# Altium project span-ion-cfd-respin.PrjPcb (part 1 of 2)
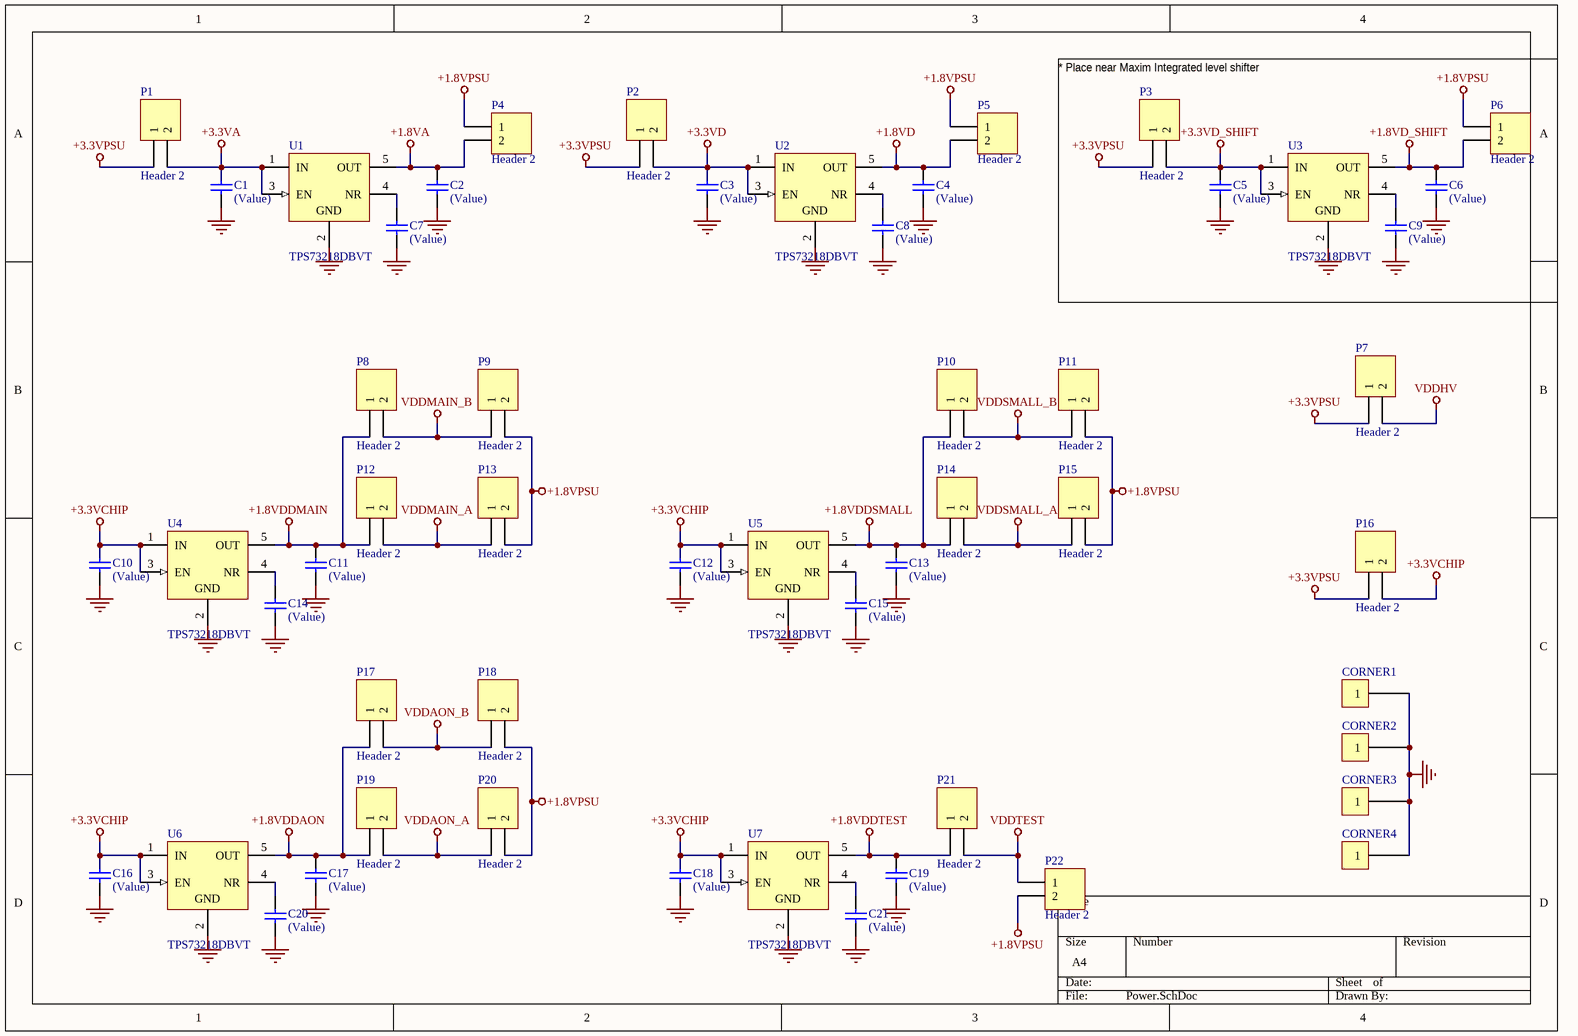
[diagram p0: Power.SchDoc]
6 sheets, 265 parts. Net scope: global (net labels, ports and power ports of the same name join across sheets).
Board file: CFD_2Channel.PcbDoc
Sheets:
  Power.SchDoc
  Teensy_Interface.SchDoc
  Mux_Demux.SchDoc
  Dual_Channel.SchDoc
  Channel_A.SchDoc
  Channel_B.SchDoc

## Sheet Power.SchDoc
size A4; SheetNumber: 1; SheetTotal: 6

### Parts
C1  (Value)  [CAPC1608X90X35ML10T15]
C2  (Value)  [CAPC1608X90X35ML10T15]
C3  (Value)  [CAPC1608X90X35ML10T15]
C4  (Value)  [CAPC1608X90X35ML10T15]
C5  (Value)  [CAPC1608X90X35ML10T15]
C6  (Value)  [CAPC1608X90X35ML10T15]
C7  (Value)  [CAPC1608X90X35ML10T15]
C8  (Value)  [CAPC1608X90X35ML10T15]
C9  (Value)  [CAPC1608X90X35ML10T15]
C10  (Value)  [CAPC1608X90X35ML10T15]
C11  (Value)  [CAPC1608X90X35ML10T15]
C12  (Value)  [CAPC1608X90X35ML10T15]
C13  (Value)  [CAPC1608X90X35ML10T15]
C14  (Value)  [CAPC1608X90X35ML10T15]
C15  (Value)  [CAPC1608X90X35ML10T15]
C16  (Value)  [CAPC1608X90X35ML10T15]
C17  (Value)  [CAPC1608X90X35ML10T15]
C18  (Value)  [CAPC1608X90X35ML10T15]
C19  (Value)  [CAPC1608X90X35ML10T15]
C20  (Value)  [CAPC1608X90X35ML10T15]
C21  (Value)  [CAPC1608X90X35ML10T15]
CORNER1  Corner Mount  [CornerMount]  (value not drawn)
CORNER2  Corner Mount  [CornerMount]  (value not drawn)
CORNER3  Corner Mount  [CornerMount]  (value not drawn)
CORNER4  Corner Mount  [CornerMount]  (value not drawn)
P1  Header 2  [HDR1X2]
P2  Header 2  [HDR1X2]
P3  Header 2  [HDR1X2]
P4  Header 2  [HDR1X2]
P5  Header 2  [HDR1X2]
P6  Header 2  [HDR1X2]
P7  Header 2  [HDR1X2]
P8  Header 2  [HDR1X2]
P9  Header 2  [HDR1X2]
P10  Header 2  [HDR1X2]
P11  Header 2  [HDR1X2]
P12  Header 2  [HDR1X2]
P13  Header 2  [HDR1X2]
P14  Header 2  [HDR1X2]
P15  Header 2  [HDR1X2]
P16  Header 2  [HDR1X2]
P17  Header 2  [HDR1X2]
P18  Header 2  [HDR1X2]
P19  Header 2  [HDR1X2]
P20  Header 2  [HDR1X2]
P21  Header 2  [HDR1X2]
P22  Header 2  [HDR1X2]
U1  TPS73218DBVT  [DBV0005A_N]
U2  TPS73218DBVT  [DBV0005A_N]
U3  TPS73218DBVT  [DBV0005A_N]
U4  TPS73218DBVT  [DBV0005A_N]
U5  TPS73218DBVT  [DBV0005A_N]
U6  TPS73218DBVT  [DBV0005A_N]
U7  TPS73218DBVT  [DBV0005A_N]

### Nets
+1.8VA: C2.1 P4.2 U1.5(OUT)
+1.8VD: C4.1 P5.2 U2.5(OUT)
+1.8VD_SHIFT: C6.1 P6.2 U3.5(OUT)
+1.8VDDAON: C17.1 P17.1 P19.1 U6.5(OUT)
+1.8VDDMAIN: C11.1 P8.1 P12.1 U4.5(OUT)
+1.8VDDSMALL: C13.1 P10.1 P14.1 U5.5(OUT)
+1.8VDDTEST: C19.1 P21.1 U7.5(OUT)
+1.8VPSU: P4.1 P5.1 P6.1 P9.2 P11.2 P13.2 P15.2 P18.2 P20.2 P22.2
+3.3VA: C1.1 P1.2 U1.1(IN) U1.3(EN)
+3.3VCHIP: C10.1 C12.1 C16.1 C18.1 P16.2 U4.1(IN) U4.3(EN) U5.1(IN) U5.3(EN) U6.1(IN) U6.3(EN) U7.1(IN) U7.3(EN)
+3.3VD: C3.1 P2.2 U2.1(IN) U2.3(EN)
+3.3VD_SHIFT: C5.1 P3.2 U3.1(IN) U3.3(EN)
+3.3VPSU: P1.1 P2.1 P3.1 P7.1 P16.1
GND: C1.2 C2.2 C3.2 C4.2 C5.2 C6.2 C7.2 C8.2 C9.2 C10.2 C11.2 C12.2 C13.2 C14.2 C15.2 C16.2 C17.2 C18.2 C19.2 C20.2 C21.2 CORNER1.1 CORNER2.1 CORNER3.1 CORNER4.1 U1.2(GND) U2.2(GND) U3.2(GND) U4.2(GND) U5.2(GND) U6.2(GND) U7.2(GND)
VDDAON_A: P19.2 P20.1
VDDAON_B: P17.2 P18.1
VDDHV: P7.2
VDDMAIN_A: P12.2 P13.1
VDDMAIN_B: P8.2 P9.1
VDDSMALL_A: P14.2 P15.1
VDDSMALL_B: P10.2 P11.1
VDDTEST: P21.2 P22.1
NetC7_1: C7.1 U1.4(NR)
NetC8_1: C8.1 U2.4(NR)
NetC9_1: C9.1 U3.4(NR)
NetC14_1: C14.1 U4.4(NR)
NetC15_1: C15.1 U5.4(NR)
NetC20_1: C20.1 U6.4(NR)
NetC21_1: C21.1 U7.4(NR)

### Notes on the sheet
- * Place near Maxim Integrated level shifter

### Library data of the parts
C1-C21 = CMP-2000-04945-1: 0603; Manufacturer: Murata; Capacitance: 22pF; Tolerance (%): ±5%; Rated Voltage: 50V; Dielectric: C0G; Manufacturer URL: http://www.murata.com/; Datasheet Version: Jul-06; Package Reference: 603; Case Size/Dimension: 0603; Package Description: 2-Pin Surface Mount Device, Body 1.6 x 0.8 mm; Datasheet URL: https://datasheet.ciiva.com/11786/0900766b807a1cab-11786398.pdf
P1-P22 = Header 2: Header, 2-Pin; LatestRevisionDate: 17-Jul-2002; LatestRevisionNote: Re-released for DXP Platform.; Publisher: Altium Limited
U1-U7 = CMP-0394-00378-2: Single Output Fast Transient Response LDO, 200 mA, Fixed 1.8 V Output, 1.7 to 5.5 V Input, with Reverse Current Protection, 5-pin SOT-23 (DBV), -40 to 85 degC, Green (RoHS & no Sb/Br); Manufacturer: Texas Instruments; Iout(Max)(A): 0.25; Iq(Typ)(mA): 0.4; Accuracy(%): 1; Vout Adj(Min)(V): 1.8; Vdo(Typ)(mV): 40; SubFamily: Single Channel LDO; Vin(Min)(V): 1.7; Vin(Max)(V): 5.5; ComponentLink1URL: http://www.ti.com/; PartNumber: TPS73218DBVT; Eco-Plan: Green (RoHS & no Sb/Br); ComponentLink2Description: Datasheet; PackageVersion: 4073253-4/K; ComponentLink3URL: http://www.ti.com/litv/pdf/mpds018i; ComponentLink3Description: Package Specification; ComponentLink1Description: Manufacturer URL; Vout Adj(Max)(V): 1.8; Code_JEDEC: MO-178; ComponentLink2URL: http://www.ti.com/general/docs/lit/getliterature.tsp?genericPartNumber=TPS73218&fileType=pdf; DatasheetVersion: SBVS037O; Mounting Technology: Surface Mount; PackageReference: DBV0005A; PackageDescription: 5-Pin Plastic Small Outline, Body 1.60 Ãƒâ€” 2.90 mm, Pitch 0.95 mm; Fixed Output Options(V): 1.8

## Sheet Teensy_Interface.SchDoc
size OrCAD E; SheetNumber: 2; SheetTotal: 6
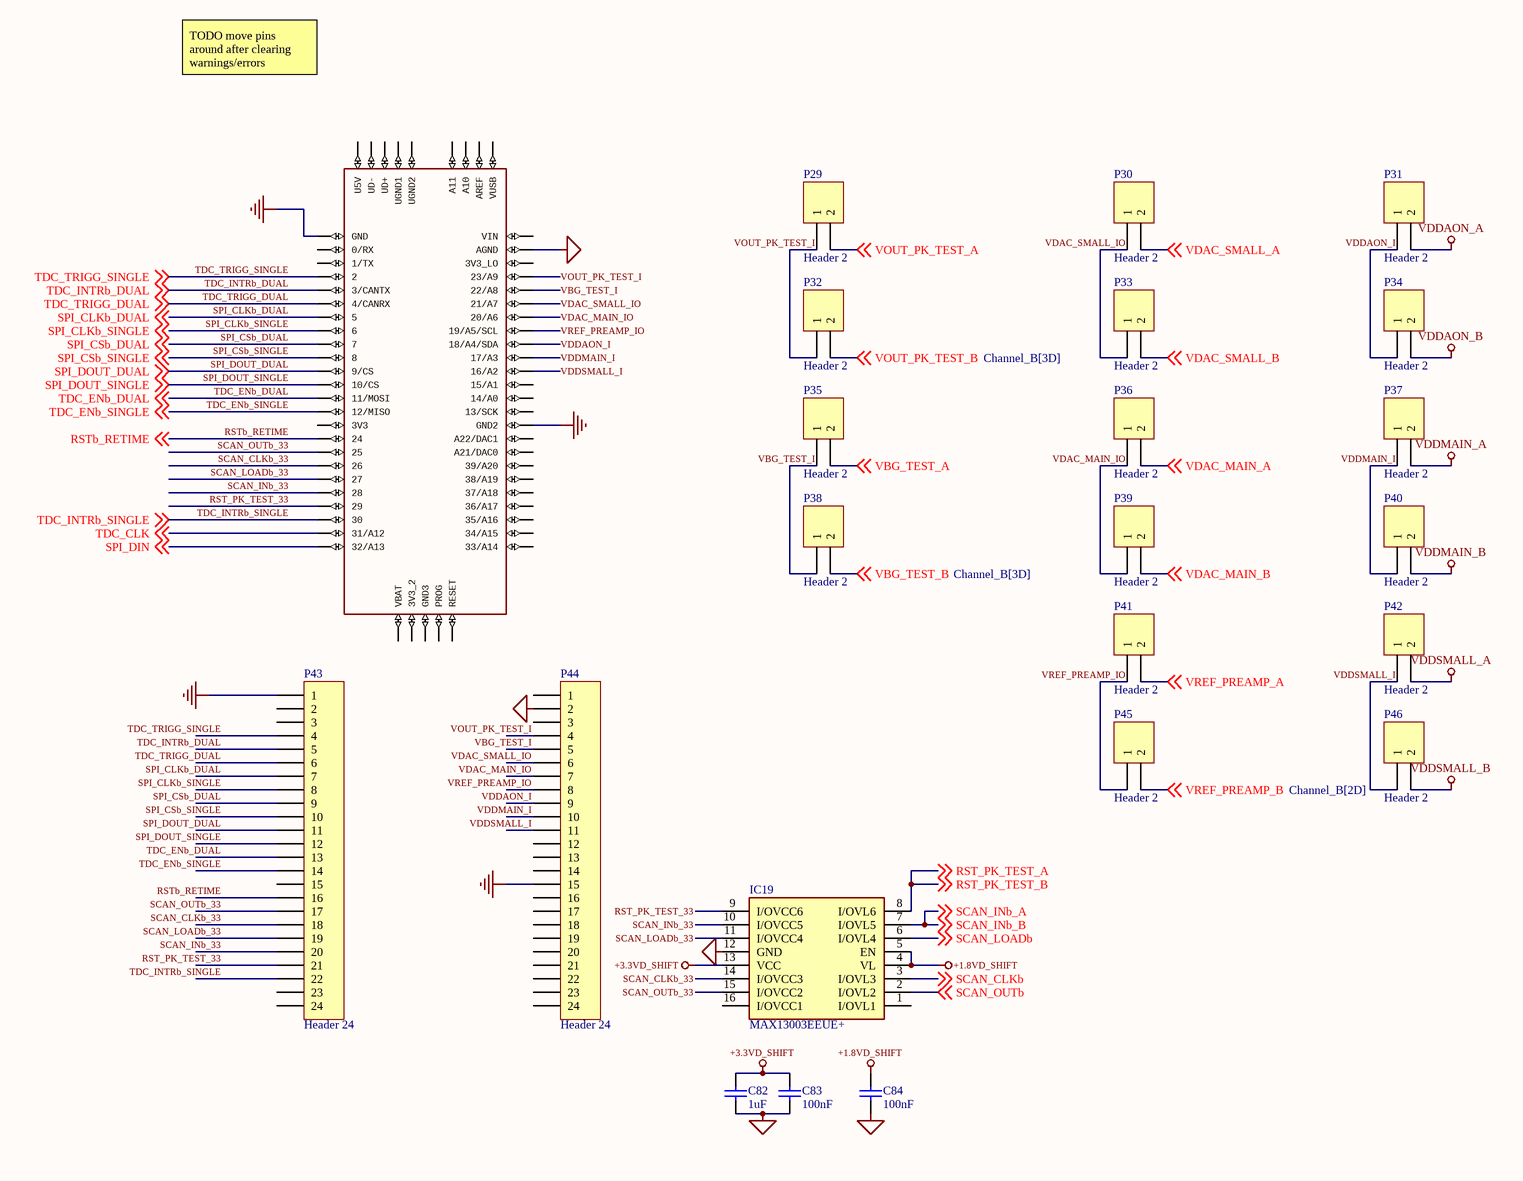
[diagram p1: Teensy_Interface.SchDoc]

### Parts
C82  1uF  [CAPC1608X90X35ML10T15]
C83  100nF  [CAPC1608X90X35ML10T15]
C84  100nF  [CAPC1608X90X35ML10T15]
IC19  MAX13003EEUE+  [SOP65P640X110-16N]
P29  Header 2  [HDR1X2]
P30  Header 2  [HDR1X2]
P31  Header 2  [HDR1X2]
P32  Header 2  [HDR1X2]
P33  Header 2  [HDR1X2]
P34  Header 2  [HDR1X2]
P35  Header 2  [HDR1X2]
P36  Header 2  [HDR1X2]
P37  Header 2  [HDR1X2]
P38  Header 2  [HDR1X2]
P39  Header 2  [HDR1X2]
P40  Header 2  [HDR1X2]
P41  Header 2  [HDR1X2]
P42  Header 2  [HDR1X2]
P43  Header 24  [HDR1X24]
P44  Header 24  [HDR1X24]
P45  Header 2  [HDR1X2]
P46  Header 2  [HDR1X2]
TEENSY1  TEENSY_3.5/3.6  [TEENSY_3.5/3.6]  (value not drawn)

### Nets
+1.8VD_SHIFT: C84.1 IC19.4(VL) IC19.5(EN)
+3.3VD_SHIFT: C82.2 C83.2 IC19.13(VCC)
GND: C82.1 C83.1 C84.2 IC19.12(GND) P43.1 P44.2 P44.15 TEENSY1.AGND TEENSY1.GND TEENSY1.GND2
VDDAON_A: P31.2
VDDAON_B: P34.2
VDDMAIN_A: P37.2
VDDMAIN_B: P40.2
VDDSMALL_A: P42.2
VDDSMALL_B: P46.2
RST_PK_TEST_33: IC19.9(I/OVCC6) P43.21 TEENSY1.29
RST_PK_TEST_A: IC19.8(I/OVL6) ; off-sheet RST_PK_TEST_A, off-sheet RST_PK_TEST_B  [also labelled RST_PK_TEST_B]
RSTb_RETIME: P43.16 TEENSY1.24 ; off-sheet RSTb_RETIME
SCAN_CLKb: IC19.3(I/OVL3) ; off-sheet SCAN_CLKb
SCAN_CLKb_33: IC19.14(I/OVCC3) P43.18 TEENSY1.26
SCAN_INb_33: IC19.10(I/OVCC5) P43.20 TEENSY1.28
SCAN_INb_A: IC19.7(I/OVL5) ; off-sheet SCAN_INb_B, off-sheet SCAN_INb_A  [also labelled SCAN_INb_B]
SCAN_LOADb: IC19.6(I/OVL4) ; off-sheet SCAN_LOADb
SCAN_LOADb_33: IC19.11(I/OVCC4) P43.19 TEENSY1.27
SCAN_OUTb: IC19.2(I/OVL2) ; off-sheet SCAN_OUTb
SCAN_OUTb_33: IC19.15(I/OVCC2) P43.17 TEENSY1.25
SPI_CLKb_DUAL: P43.7 TEENSY1.5 ; off-sheet SPI_CLKb_DUAL
SPI_CLKb_SINGLE: P43.8 TEENSY1.6 ; off-sheet SPI_CLKb_SINGLE
SPI_CSb_DUAL: P43.9 TEENSY1.7 ; off-sheet SPI_CSb_DUAL
SPI_CSb_SINGLE: P43.10 TEENSY1.8 ; off-sheet SPI_CSb_SINGLE
SPI_DIN: TEENSY1.32/A13 ; off-sheet SPI_DIN
SPI_DOUT_DUAL: P43.11 TEENSY1.9/CS ; off-sheet SPI_DOUT_DUAL
SPI_DOUT_SINGLE: P43.12 TEENSY1.10/CS ; off-sheet SPI_DOUT_SINGLE
TDC_CLK: TEENSY1.31/A12 ; off-sheet TDC_CLK
TDC_ENb_DUAL: P43.13 TEENSY1.11/MOSI ; off-sheet TDC_ENb_DUAL
TDC_ENb_SINGLE: P43.14 TEENSY1.12/MISO ; off-sheet TDC_ENb_SINGLE
TDC_INTRb_DUAL: P43.5 TEENSY1.3/CANTX ; off-sheet TDC_INTRb_DUAL
TDC_INTRb_SINGLE: P43.22 TEENSY1.30 ; off-sheet TDC_INTRb_SINGLE
TDC_TRIGG_DUAL: P43.6 TEENSY1.4/CANRX ; off-sheet TDC_TRIGG_DUAL
TDC_TRIGG_SINGLE: P43.4 TEENSY1.2 ; off-sheet TDC_TRIGG_SINGLE
VBG_TEST_A: P35.2 ; off-sheet VBG_TEST_A
VBG_TEST_B: P38.2 ; off-sheet VBG_TEST_B
VBG_TEST_I: P35.1 P38.1 P44.5 TEENSY1.22/A8
VDAC_MAIN_A: P36.2 ; off-sheet VDAC_MAIN_A
VDAC_MAIN_B: P39.2 ; off-sheet VDAC_MAIN_B
VDAC_MAIN_IO: P36.1 P39.1 P44.7 TEENSY1.20/A6
VDAC_SMALL_A: P30.2 ; off-sheet VDAC_SMALL_A
VDAC_SMALL_B: P33.2 ; off-sheet VDAC_SMALL_B
VDAC_SMALL_IO: P30.1 P33.1 P44.6 TEENSY1.21/A7
VDDAON_I: P31.1 P34.1 P44.9 TEENSY1.18/A4/SDA
VDDMAIN_I: P37.1 P40.1 P44.10 TEENSY1.17/A3
VDDSMALL_I: P42.1 P44.11 P46.1 TEENSY1.16/A2
VOUT_PK_TEST_A: P29.2 ; off-sheet VOUT_PK_TEST_A
VOUT_PK_TEST_B: P32.2 ; off-sheet VOUT_PK_TEST_B
VOUT_PK_TEST_I: P29.1 P32.1 P44.4 TEENSY1.23/A9
VREF_PREAMP_A: P41.2 ; off-sheet VREF_PREAMP_A
VREF_PREAMP_B: P45.2 ; off-sheet VREF_PREAMP_B
VREF_PREAMP_IO: P41.1 P44.8 P45.1 TEENSY1.19/A5/SCL

Not connected (* = marked no-connect by the designer): IC19 1(I/OVL1) 16(I/OVCC1); P43 2 3 15 23 24; P44 1 3 12 13 14 16 17 18 19 20 21 22 23 24; TEENSY1 0/RX 1/TX 3V3 3V3_2 3V3_LO 13/SCK 14/A0 15/A1 21/DAC0(A21/DAC0) 33/A14 34/A15 35/A16 36/A17 37/A18 38/A19 39/A20 A10 A11 A22/DAC1 AREF GND3 PROG RESET U5V UD+ UD- UGND1 UGND2 VBAT VIN VUSB

### Notes on the sheet
- TODO move pins around after clearing warnings/errors

### Library data of the parts
C82-C84 = CMP-2000-04945-1: as C1 on sheet Power; Manufacturer URL: http://www.murata.com/; Datasheet Version: Jul-06; Package Reference: 603; Case Size/Dimension: 0603; Package Description: 2-Pin Surface Mount Device, Body 1.6 x 0.8 mm; Datasheet URL: https://datasheet.ciiva.com/11786/0900766b807a1cab-11786398.pdf
IC19 = MAX13003EEUE+: Integrated Circuit; Manufacturer_Name: Maxim Integrated; Datasheet Link: https://pdfserv.maximintegrated.com/en/ds/MAX13000E-MAX13005E.pdf; Height: 1.1mm; Manufacturer_Part_Number: MAX13003EEUE+
P29-P42 P45 P46 = Header 2: Header, 2-Pin; LatestRevisionDate: 17-Jul-2002; LatestRevisionNote: Re-released for DXP Platform.; Publisher: Altium Limited
P43 P44 = Header 24: Header, 24-Pin; LatestRevisionDate: 17-Jul-2002; LatestRevisionNote: Re-released for DXP Platform.; Publisher: Altium Limited
TEENSY1 = TEENSY_3.5/3.6: GateName_1: G$1; SymbolName_1: TEENSY_3.5/3.6; LibraryName: Teensy356; DeviceSetName: TEENSY_3.5/3.6; Package: TEENSY_3.5/3.6

## Sheet Mux_Demux.SchDoc
size OrCAD E; SheetNumber: 3; SheetTotal: 6
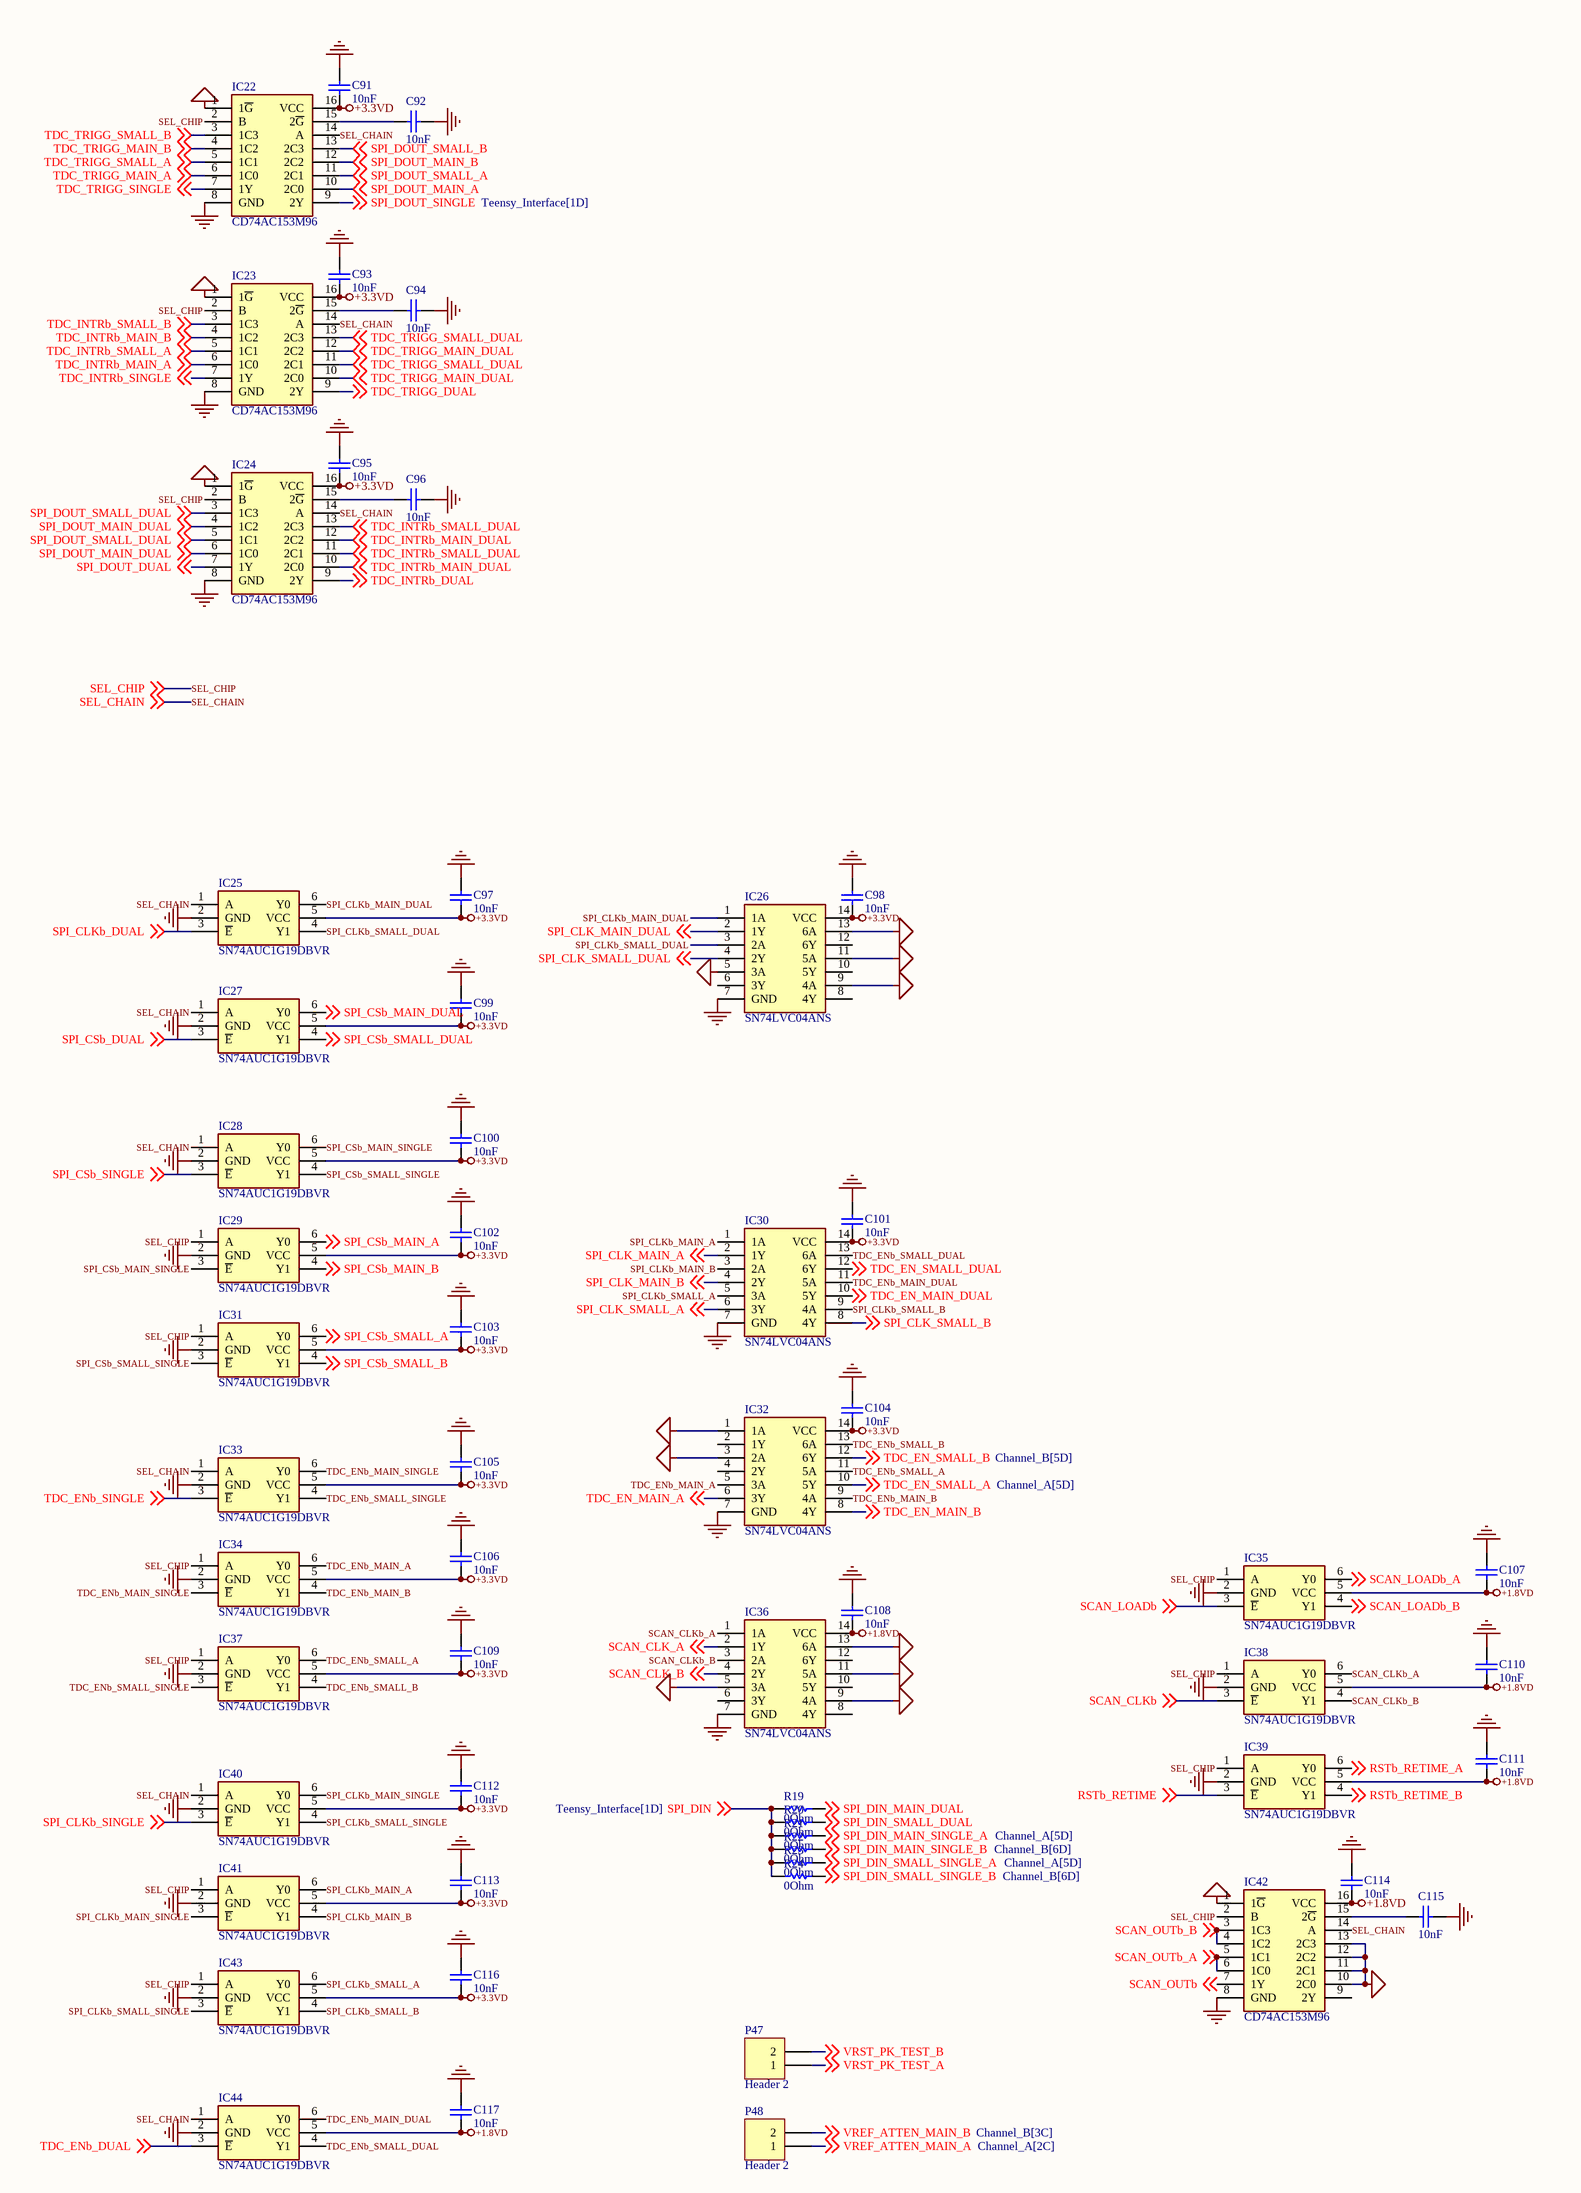
[diagram p2: Mux_Demux.SchDoc]

### Parts
C91  10nF  [CAPC1608X90X35ML10T15]
C92  10nF  [CAPC1608X90X35ML10T15]
C93  10nF  [CAPC1608X90X35ML10T15]
C94  10nF  [CAPC1608X90X35ML10T15]
C95  10nF  [CAPC1608X90X35ML10T15]
C96  10nF  [CAPC1608X90X35ML10T15]
C97  10nF  [CAPC1608X90X35ML10T15]
C98  10nF  [CAPC1608X90X35ML10T15]
C99  10nF  [CAPC1608X90X35ML10T15]
C100  10nF  [CAPC1608X90X35ML10T15]
C101  10nF  [CAPC1608X90X35ML10T15]
C102  10nF  [CAPC1608X90X35ML10T15]
C103  10nF  [CAPC1608X90X35ML10T15]
C104  10nF  [CAPC1608X90X35ML10T15]
C105  10nF  [CAPC1608X90X35ML10T15]
C106  10nF  [CAPC1608X90X35ML10T15]
C107  10nF  [CAPC1608X90X35ML10T15]
C108  10nF  [CAPC1608X90X35ML10T15]
C109  10nF  [CAPC1608X90X35ML10T15]
C110  10nF  [CAPC1608X90X35ML10T15]
C111  10nF  [CAPC1608X90X35ML10T15]
C112  10nF  [CAPC1608X90X35ML10T15]
C113  10nF  [CAPC1608X90X35ML10T15]
C114  10nF  [CAPC1608X90X35ML10T15]
C115  10nF  [CAPC1608X90X35ML10T15]
C116  10nF  [CAPC1608X90X35ML10T15]
C117  10nF  [CAPC1608X90X35ML10T15]
IC22  CD74AC153M96  [SOIC127P600X175-16N]
IC23  CD74AC153M96  [SOIC127P600X175-16N]
IC24  CD74AC153M96  [SOIC127P600X175-16N]
IC25  SN74AUC1G19DBVR  [SOT95P280X145-6N]
IC26  SN74LVC04ANS  [SOIC127P780X200-14N]
IC27  SN74AUC1G19DBVR  [SOT95P280X145-6N]
IC28  SN74AUC1G19DBVR  [SOT95P280X145-6N]
IC29  SN74AUC1G19DBVR  [SOT95P280X145-6N]
IC30  SN74LVC04ANS  [SOIC127P780X200-14N]
IC31  SN74AUC1G19DBVR  [SOT95P280X145-6N]
IC32  SN74LVC04ANS  [SOIC127P780X200-14N]
IC33  SN74AUC1G19DBVR  [SOT95P280X145-6N]
IC34  SN74AUC1G19DBVR  [SOT95P280X145-6N]
IC35  SN74AUC1G19DBVR  [SOT95P280X145-6N]
IC36  SN74LVC04ANS  [SOIC127P780X200-14N]
IC37  SN74AUC1G19DBVR  [SOT95P280X145-6N]
IC38  SN74AUC1G19DBVR  [SOT95P280X145-6N]
IC39  SN74AUC1G19DBVR  [SOT95P280X145-6N]
IC40  SN74AUC1G19DBVR  [SOT95P280X145-6N]
IC41  SN74AUC1G19DBVR  [SOT95P280X145-6N]
IC42  CD74AC153M96  [SOIC127P600X175-16N]
IC43  SN74AUC1G19DBVR  [SOT95P280X145-6N]
IC44  SN74AUC1G19DBVR  [SOT95P280X145-6N]
P47  Header 2  [HDR1X2]
P48  Header 2  [HDR1X2]
R19  0Ohm  [RESC1609X50X30NL8T20]
R20  0Ohm  [RESC1609X50X30NL8T20]
R21  0Ohm  [RESC1609X50X30NL8T20]
R22  0Ohm  [RESC1609X50X30NL8T20]
R23  0Ohm  [RESC1609X50X30NL8T20]
R24  0Ohm  [RESC1609X50X30NL8T20]

### Nets
+1.8VD: C107.1 C108.1 C110.1 C111.1 C114.1 C117.1 IC35.5(VCC) IC36.14(VCC) IC38.5(VCC) IC39.5(VCC) IC42.16(VCC) IC44.5(VCC)
+3.3VD: C91.1 C93.1 C95.1 C97.1 C98.1 C99.1 C100.1 C101.1 C102.1 C103.1 C104.1 C105.1 C106.1 C109.1 C112.1 C113.1 C116.1 IC22.16(VCC) IC23.16(VCC) IC24.16(VCC) IC25.5(VCC) IC26.14(VCC) IC27.5(VCC) IC28.5(VCC) IC29.5(VCC) IC30.14(VCC) IC31.5(VCC) IC32.14(VCC) IC33.5(VCC) IC34.5(VCC) IC37.5(VCC) IC40.5(VCC) IC41.5(VCC) IC43.5(VCC)
GND: C91.2 C92.2 C93.2 C94.2 C95.2 C96.2 C97.2 C98.2 C99.2 C100.2 C101.2 C102.2 C103.2 C104.2 C105.2 C106.2 C107.2 C108.2 C109.2 C110.2 C111.2 C112.2 C113.2 C114.2 C115.2 C116.2 C117.2 IC22.1(1~{G}) IC22.8(GND) IC23.1(1~{G}) IC23.8(GND) IC24.1(1~{G}) IC24.8(GND) IC25.2(GND) IC26.5(3A) IC26.7(GND) IC26.9(4A) IC26.11(5A) IC26.13(6A) IC27.2(GND) IC28.2(GND) IC29.2(GND) IC30.7(GND) IC31.2(GND) IC32.1(1A) IC32.3(2A) IC32.7(GND) IC33.2(GND) IC34.2(GND) IC35.2(GND) IC36.5(3A) IC36.7(GND) IC36.9(4A) IC36.11(5A) IC36.13(6A) IC37.2(GND) IC38.2(GND) IC39.2(GND) IC40.2(GND) IC41.2(GND) IC42.1(1~{G}) IC42.8(GND) IC42.10(2C0) IC42.11(2C1) IC42.12(2C2) IC42.13(2C3) IC43.2(GND) IC44.2(GND)
RSTb_RETIME: IC39.3(~{E}) ; off-sheet RSTb_RETIME
RSTb_RETIME_A: IC39.6(Y0) ; off-sheet RSTb_RETIME_A
RSTb_RETIME_B: IC39.4(Y1) ; off-sheet RSTb_RETIME_B
SCAN_CLK_A: IC36.2(1Y) ; off-sheet SCAN_CLK_A
SCAN_CLK_B: IC36.4(2Y) ; off-sheet SCAN_CLK_B
SCAN_CLKb: IC38.3(~{E}) ; off-sheet SCAN_CLKb
SCAN_CLKb_A: IC36.1(1A) IC38.6(Y0)
SCAN_CLKb_B: IC36.3(2A) IC38.4(Y1)
SCAN_LOADb: IC35.3(~{E}) ; off-sheet SCAN_LOADb
SCAN_LOADb_A: IC35.6(Y0) ; off-sheet SCAN_LOADb_A
SCAN_LOADb_B: IC35.4(Y1) ; off-sheet SCAN_LOADb_B
SCAN_OUTb: IC42.7(1Y) ; off-sheet SCAN_OUTb
SCAN_OUTb_A: IC42.5(1C1) IC42.6(1C0) ; off-sheet SCAN_OUTb_A
SCAN_OUTb_B: IC42.3(1C3) IC42.4(1C2) ; off-sheet SCAN_OUTb_B
SEL_CHAIN: IC22.14(A) IC23.14(A) IC24.14(A) IC25.1(A) IC27.1(A) IC28.1(A) IC33.1(A) IC40.1(A) IC42.14(A) IC44.1(A) ; off-sheet SEL_CHAIN
SEL_CHIP: IC22.2(B) IC23.2(B) IC24.2(B) IC29.1(A) IC31.1(A) IC34.1(A) IC35.1(A) IC37.1(A) IC38.1(A) IC39.1(A) IC41.1(A) IC42.2(B) IC43.1(A) ; off-sheet SEL_CHIP
SPI_CLK_MAIN_A: IC30.2(1Y) ; off-sheet SPI_CLK_MAIN_A
SPI_CLK_MAIN_B: IC30.4(2Y) ; off-sheet SPI_CLK_MAIN_B
SPI_CLK_MAIN_DUAL: IC26.2(1Y) ; off-sheet SPI_CLK_MAIN_DUAL
SPI_CLK_SMALL_A: IC30.6(3Y) ; off-sheet SPI_CLK_SMALL_A
SPI_CLK_SMALL_B: IC30.8(4Y) ; off-sheet SPI_CLK_SMALL_B
SPI_CLK_SMALL_DUAL: IC26.4(2Y) ; off-sheet SPI_CLK_SMALL_DUAL
SPI_CLKb_DUAL: IC25.3(~{E}) ; off-sheet SPI_CLKb_DUAL
SPI_CLKb_MAIN_A: IC30.1(1A) IC41.6(Y0)
SPI_CLKb_MAIN_B: IC30.3(2A) IC41.4(Y1)
SPI_CLKb_MAIN_DUAL: IC25.6(Y0) IC26.1(1A)
SPI_CLKb_MAIN_SINGLE: IC40.6(Y0) IC41.3(~{E})
SPI_CLKb_SINGLE: IC40.3(~{E}) ; off-sheet SPI_CLKb_SINGLE
SPI_CLKb_SMALL_A: IC30.5(3A) IC43.6(Y0)
SPI_CLKb_SMALL_B: IC30.9(4A) IC43.4(Y1)
SPI_CLKb_SMALL_DUAL: IC25.4(Y1) IC26.3(2A)
SPI_CLKb_SMALL_SINGLE: IC40.4(Y1) IC43.3(~{E})
SPI_CSb_DUAL: IC27.3(~{E}) ; off-sheet SPI_CSb_DUAL
SPI_CSb_MAIN_A: IC29.6(Y0) ; off-sheet SPI_CSb_MAIN_A
SPI_CSb_MAIN_B: IC29.4(Y1) ; off-sheet SPI_CSb_MAIN_B
SPI_CSb_MAIN_DUAL: IC27.6(Y0) ; off-sheet SPI_CSb_MAIN_DUAL
SPI_CSb_MAIN_SINGLE: IC28.6(Y0) IC29.3(~{E})
SPI_CSb_SINGLE: IC28.3(~{E}) ; off-sheet SPI_CSb_SINGLE
SPI_CSb_SMALL_A: IC31.6(Y0) ; off-sheet SPI_CSb_SMALL_A
SPI_CSb_SMALL_B: IC31.4(Y1) ; off-sheet SPI_CSb_SMALL_B
SPI_CSb_SMALL_DUAL: IC27.4(Y1) ; off-sheet SPI_CSb_SMALL_DUAL
SPI_CSb_SMALL_SINGLE: IC28.4(Y1) IC31.3(~{E})
SPI_DIN: R19.2 R20.2 R21.2 R22.2 R23.2 R24.2 ; off-sheet SPI_DIN
SPI_DIN_MAIN_DUAL: R19.1 ; off-sheet SPI_DIN_MAIN_DUAL
SPI_DIN_MAIN_SINGLE_A: R21.1 ; off-sheet SPI_DIN_MAIN_SINGLE_A
SPI_DIN_MAIN_SINGLE_B: R22.1 ; off-sheet SPI_DIN_MAIN_SINGLE_B
SPI_DIN_SMALL_DUAL: R20.1 ; off-sheet SPI_DIN_SMALL_DUAL
SPI_DIN_SMALL_SINGLE_A: R23.1 ; off-sheet SPI_DIN_SMALL_SINGLE_A
SPI_DIN_SMALL_SINGLE_B: R24.1 ; off-sheet SPI_DIN_SMALL_SINGLE_B
SPI_DOUT_DUAL: IC24.7(1Y) ; off-sheet SPI_DOUT_DUAL
SPI_DOUT_MAIN_A: IC22.10(2C0) ; off-sheet SPI_DOUT_MAIN_A
SPI_DOUT_MAIN_B: IC22.12(2C2) ; off-sheet SPI_DOUT_MAIN_B
SPI_DOUT_MAIN_DUAL: IC24.4(1C2) IC24.6(1C0) ; off-sheet SPI_DOUT_MAIN_DUAL
SPI_DOUT_SINGLE: IC22.9(2Y) ; off-sheet SPI_DOUT_SINGLE
SPI_DOUT_SMALL_A: IC22.11(2C1) ; off-sheet SPI_DOUT_SMALL_A
SPI_DOUT_SMALL_B: IC22.13(2C3) ; off-sheet SPI_DOUT_SMALL_B
SPI_DOUT_SMALL_DUAL: IC24.3(1C3) IC24.5(1C1) ; off-sheet SPI_DOUT_SMALL_DUAL
TDC_EN_MAIN_A: IC32.6(3Y) ; off-sheet TDC_EN_MAIN_A
TDC_EN_MAIN_B: IC32.8(4Y) ; off-sheet TDC_EN_MAIN_B
TDC_EN_MAIN_DUAL: IC30.10(5Y) ; off-sheet TDC_EN_MAIN_DUAL
TDC_EN_SMALL_A: IC32.10(5Y) ; off-sheet TDC_EN_SMALL_A
TDC_EN_SMALL_B: IC32.12(6Y) ; off-sheet TDC_EN_SMALL_B
TDC_EN_SMALL_DUAL: IC30.12(6Y) ; off-sheet TDC_EN_SMALL_DUAL
TDC_ENb_DUAL: IC44.3(~{E}) ; off-sheet TDC_ENb_DUAL
TDC_ENb_MAIN_A: IC32.5(3A) IC34.6(Y0)
TDC_ENb_MAIN_B: IC32.9(4A) IC34.4(Y1)
TDC_ENb_MAIN_DUAL: IC30.11(5A) IC44.6(Y0)
TDC_ENb_MAIN_SINGLE: IC33.6(Y0) IC34.3(~{E})
TDC_ENb_SINGLE: IC33.3(~{E}) ; off-sheet TDC_ENb_SINGLE
TDC_ENb_SMALL_A: IC32.11(5A) IC37.6(Y0)
TDC_ENb_SMALL_B: IC32.13(6A) IC37.4(Y1)
TDC_ENb_SMALL_DUAL: IC30.13(6A) IC44.4(Y1)
TDC_ENb_SMALL_SINGLE: IC33.4(Y1) IC37.3(~{E})
TDC_INTRb_DUAL: IC24.9(2Y) ; off-sheet TDC_INTRb_DUAL
TDC_INTRb_MAIN_A: IC23.6(1C0) ; off-sheet TDC_INTRb_MAIN_A
TDC_INTRb_MAIN_B: IC23.4(1C2) ; off-sheet TDC_INTRb_MAIN_B
TDC_INTRb_MAIN_DUAL: IC24.10(2C0) IC24.12(2C2) ; off-sheet TDC_INTRb_MAIN_DUAL
TDC_INTRb_SINGLE: IC23.7(1Y) ; off-sheet TDC_INTRb_SINGLE
TDC_INTRb_SMALL_A: IC23.5(1C1) ; off-sheet TDC_INTRb_SMALL_A
TDC_INTRb_SMALL_B: IC23.3(1C3) ; off-sheet TDC_INTRb_SMALL_B
TDC_INTRb_SMALL_DUAL: IC24.11(2C1) IC24.13(2C3) ; off-sheet TDC_INTRb_SMALL_DUAL
TDC_TRIGG_DUAL: IC23.9(2Y) ; off-sheet TDC_TRIGG_DUAL
TDC_TRIGG_MAIN_A: IC22.6(1C0) ; off-sheet TDC_TRIGG_MAIN_A
TDC_TRIGG_MAIN_B: IC22.4(1C2) ; off-sheet TDC_TRIGG_MAIN_B
TDC_TRIGG_MAIN_DUAL: IC23.10(2C0) IC23.12(2C2) ; off-sheet TDC_TRIGG_MAIN_DUAL
TDC_TRIGG_SINGLE: IC22.7(1Y) ; off-sheet TDC_TRIGG_SINGLE
TDC_TRIGG_SMALL_A: IC22.5(1C1) ; off-sheet TDC_TRIGG_SMALL_A
TDC_TRIGG_SMALL_B: IC22.3(1C3) ; off-sheet TDC_TRIGG_SMALL_B
TDC_TRIGG_SMALL_DUAL: IC23.11(2C1) IC23.13(2C3) ; off-sheet TDC_TRIGG_SMALL_DUAL
VREF_ATTEN_MAIN_A: P48.1 ; off-sheet VREF_ATTEN_MAIN_A
VREF_ATTEN_MAIN_B: P48.2 ; off-sheet VREF_ATTEN_MAIN_B
VRST_PK_TEST_A: P47.1 ; off-sheet VRST_PK_TEST_A
VRST_PK_TEST_B: P47.2 ; off-sheet VRST_PK_TEST_B
NetC92_1: C92.1 IC22.15(2~{G})
NetC94_1: C94.1 IC23.15(2~{G})
NetC96_1: C96.1 IC24.15(2~{G})
NetC115_1: C115.1 IC42.15(2~{G})

Not connected (* = marked no-connect by the designer): IC26 6(3Y) 8(4Y) 10(5Y) 12(6Y); IC32 2(1Y) 4(2Y); IC36 6(3Y) 8(4Y) 10(5Y) 12(6Y); IC42 9(2Y)

### Library data of the parts
C91-C117 = CMP-2000-04945-1: as C1 on sheet Power; Manufacturer URL: http://www.murata.com/; Datasheet Version: Jul-06; Package Reference: 603; Case Size/Dimension: 0603; Package Description: 2-Pin Surface Mount Device, Body 1.6 x 0.8 mm; Datasheet URL: https://datasheet.ciiva.com/11786/0900766b807a1cab-11786398.pdf
IC22-IC24 IC42 = CD74AC153M96: Encoders, Decoders, Multiplexers & Demultiplexers Dual 4-Input; Manufacturer_Name: Texas Instruments; Datasheet Link: https://www.ti.com/lit/ds/symlink/cd74ac153.pdf?ts=1617785711495&ref_url=https%253A%252F%252Fwww.ti.com%252Fstore%252Fti%252Fen%252Fp%252Fproduct%252F%253Fp%253DCD74AC153M96; Height: 1.75mm; Manufacturer_Part_Number: CD74AC153M96; Mouser Part Number: 595-CD74AC153M96; Mouser Price/Stock: https://www.mouser.co.uk/ProductDetail/Texas-Instruments/CD74AC153M96?qs=bkMXpVdiF41Yiv9m4vuwDg%3D%3D; Arrow Part Number: CD74AC153M96; Arrow Price/Stock: https://www.arrow.com/en/products/cd74ac153m96/texas-instruments
IC25 IC27-IC29 IC31 IC33-IC35 IC37-IC41 IC43 IC44 = SN74AUC1G19DBVR: Encoders, Decoders, Multiplexers & Demultiplexers 1 of 2 Decoder DeMultxe; Manufacturer_Name: Texas Instruments; Datasheet Link: http://www.ti.com/lit/gpn/sn74auc1g19; Height: 1.45mm; Manufacturer_Part_Number: SN74AUC1G19DBVR; Mouser Part Number: 595-SN74AUC1G19DBVR; Mouser Price/Stock: https://www.mouser.com/Search/Refine.aspx?Keyword=595-SN74AUC1G19DBVR
IC26 IC30 IC32 IC36 = SN74LVC04ANS: Inverters Hex Inverter; Manufacturer_Name: Texas Instruments; Datasheet Link: http://www.ti.com/lit/ds/symlink/sn74lvc04a.pdf; Height: 2mm; Manufacturer_Part_Number: SN74LVC04ANS; Mouser Part Number: 595-SN74LVC04ANS; Mouser Price/Stock: https://www.mouser.co.uk/ProductDetail/Texas-Instruments/SN74LVC04ANS?qs=4%2FQr8XCwynNuUCMn78xqww%3D%3D
P47 P48 = Header 2: Header, 2-Pin; LatestRevisionDate: 17-Jul-2002; LatestRevisionNote: Re-released for DXP Platform.; Publisher: Altium Limited
R19-R24 = CMP-2000-03816-5: 0603; Manufacturer: Vishay Semiconductor; Voltage Rating: 75 V; Package Quantity: 5000; DatasheetVersion: 06/2012; Min Operating Temperature: -55 degC; ComponentLink1URL: http://www.vishay.com/; Mounting Technology: Surface Mount; Height: 0.45 mm; ComponentLink1Description: Manufacturer URL; REACH SVHC: Unknown; PackageReference: 0603; Packaging: Tape and Reel; Max Operating Temperature: 155 degC; Mount: Surface Mount; ComponentLink2Description: Datasheet; PackageDescription: 2-Pin Surface Mount Device, Body 1.575 x 0.85 mm; Length: 1.55 mm; ComponentLink2URL: http://www.vishay.com/docs/20035/dcrcwe3.pdf; Pins: 2; RoHSCompliant: true

## Sheet Dual_Channel.SchDoc
size OrCAD E; SheetNumber: 4; SheetTotal: 6
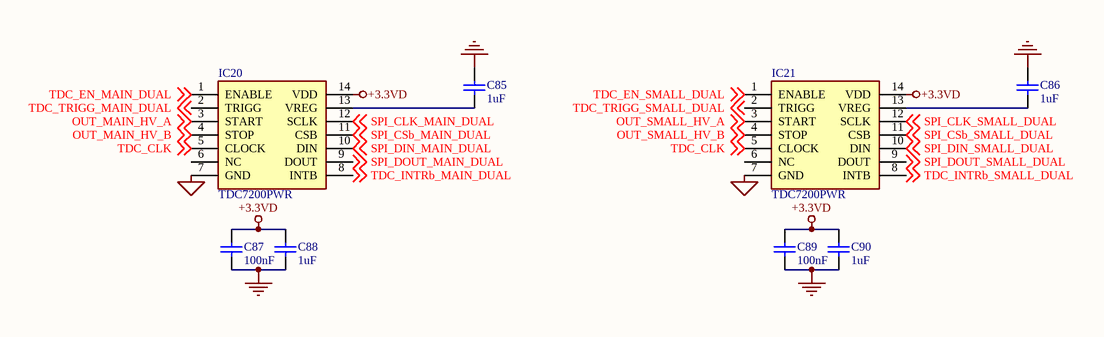
[diagram p3: Dual_Channel.SchDoc]

### Parts
C85  1uF  [CAPC1608X90X35ML10T15]
C86  1uF  [CAPC1608X90X35ML10T15]
C87  100nF  [CAPC1608X90X35ML10T15]
C88  1uF  [CAPC1608X90X35ML10T15]
C89  100nF  [CAPC1608X90X35ML10T15]
C90  1uF  [CAPC1608X90X35ML10T15]
IC20  TDC7200PWR  [SOP65P640X120-14N]
IC21  TDC7200PWR  [SOP65P640X120-14N]

### Nets
+3.3VD: C87.1 C88.1 C89.1 C90.1 IC20.14(VDD) IC21.14(VDD)
GND: C85.2 C86.2 C87.2 C88.2 C89.2 C90.2 IC20.7(GND) IC21.7(GND)
OUT_MAIN_HV_A: IC20.3(START) ; off-sheet OUT_MAIN_HV_A
OUT_MAIN_HV_B: IC20.4(STOP) ; off-sheet OUT_MAIN_HV_B
OUT_SMALL_HV_A: IC21.3(START) ; off-sheet OUT_SMALL_HV_A
OUT_SMALL_HV_B: IC21.4(STOP) ; off-sheet OUT_SMALL_HV_B
SPI_CLK_MAIN_DUAL: IC20.12(SCLK) ; off-sheet SPI_CLK_MAIN_DUAL
SPI_CLK_SMALL_DUAL: IC21.12(SCLK) ; off-sheet SPI_CLK_SMALL_DUAL
SPI_CSb_MAIN_DUAL: IC20.11(CSB) ; off-sheet SPI_CSb_MAIN_DUAL
SPI_CSb_SMALL_DUAL: IC21.11(CSB) ; off-sheet SPI_CSb_SMALL_DUAL
SPI_DIN_MAIN_DUAL: IC20.10(DIN) ; off-sheet SPI_DIN_MAIN_DUAL
SPI_DIN_SMALL_DUAL: IC21.10(DIN) ; off-sheet SPI_DIN_SMALL_DUAL
SPI_DOUT_MAIN_DUAL: IC20.9(DOUT) ; off-sheet SPI_DOUT_MAIN_DUAL
SPI_DOUT_SMALL_DUAL: IC21.9(DOUT) ; off-sheet SPI_DOUT_SMALL_DUAL
TDC_CLK: IC20.5(CLOCK) IC21.5(CLOCK) ; off-sheet TDC_CLK
TDC_EN_MAIN_DUAL: IC20.1(ENABLE) ; off-sheet TDC_EN_MAIN_DUAL
TDC_EN_SMALL_DUAL: IC21.1(ENABLE) ; off-sheet TDC_EN_SMALL_DUAL
TDC_INTRb_MAIN_DUAL: IC20.8(INTB) ; off-sheet TDC_INTRb_MAIN_DUAL
TDC_INTRb_SMALL_DUAL: IC21.8(INTB) ; off-sheet TDC_INTRb_SMALL_DUAL
TDC_TRIGG_MAIN_DUAL: IC20.2(TRIGG) ; off-sheet TDC_TRIGG_MAIN_DUAL
TDC_TRIGG_SMALL_DUAL: IC21.2(TRIGG) ; off-sheet TDC_TRIGG_SMALL_DUAL
NetC85_1: C85.1 IC20.13(VREG)
NetC86_1: C86.1 IC21.13(VREG)

Not connected (* = marked no-connect by the designer): IC20 6(NC); IC21 6(NC)

### Library data of the parts
C85-C90 = CMP-2000-04945-1: as C1 on sheet Power; Manufacturer URL: http://www.murata.com/; Datasheet Version: Jul-06; Package Reference: 603; Case Size/Dimension: 0603; Package Description: 2-Pin Surface Mount Device, Body 1.6 x 0.8 mm; Datasheet URL: https://datasheet.ciiva.com/11786/0900766b807a1cab-11786398.pdf
IC20 IC21 = TDC7200PWR: Integrated Circuit; Manufacturer_Name: Texas Instruments; Datasheet Link: http://www.ti.com/lit/gpn/tdc7200; Height: 1.2mm; Manufacturer_Part_Number: TDC7200PWR

## Sheet Channel_A.SchDoc
size OrCAD E; SheetNumber: 5; SheetTotal: 6
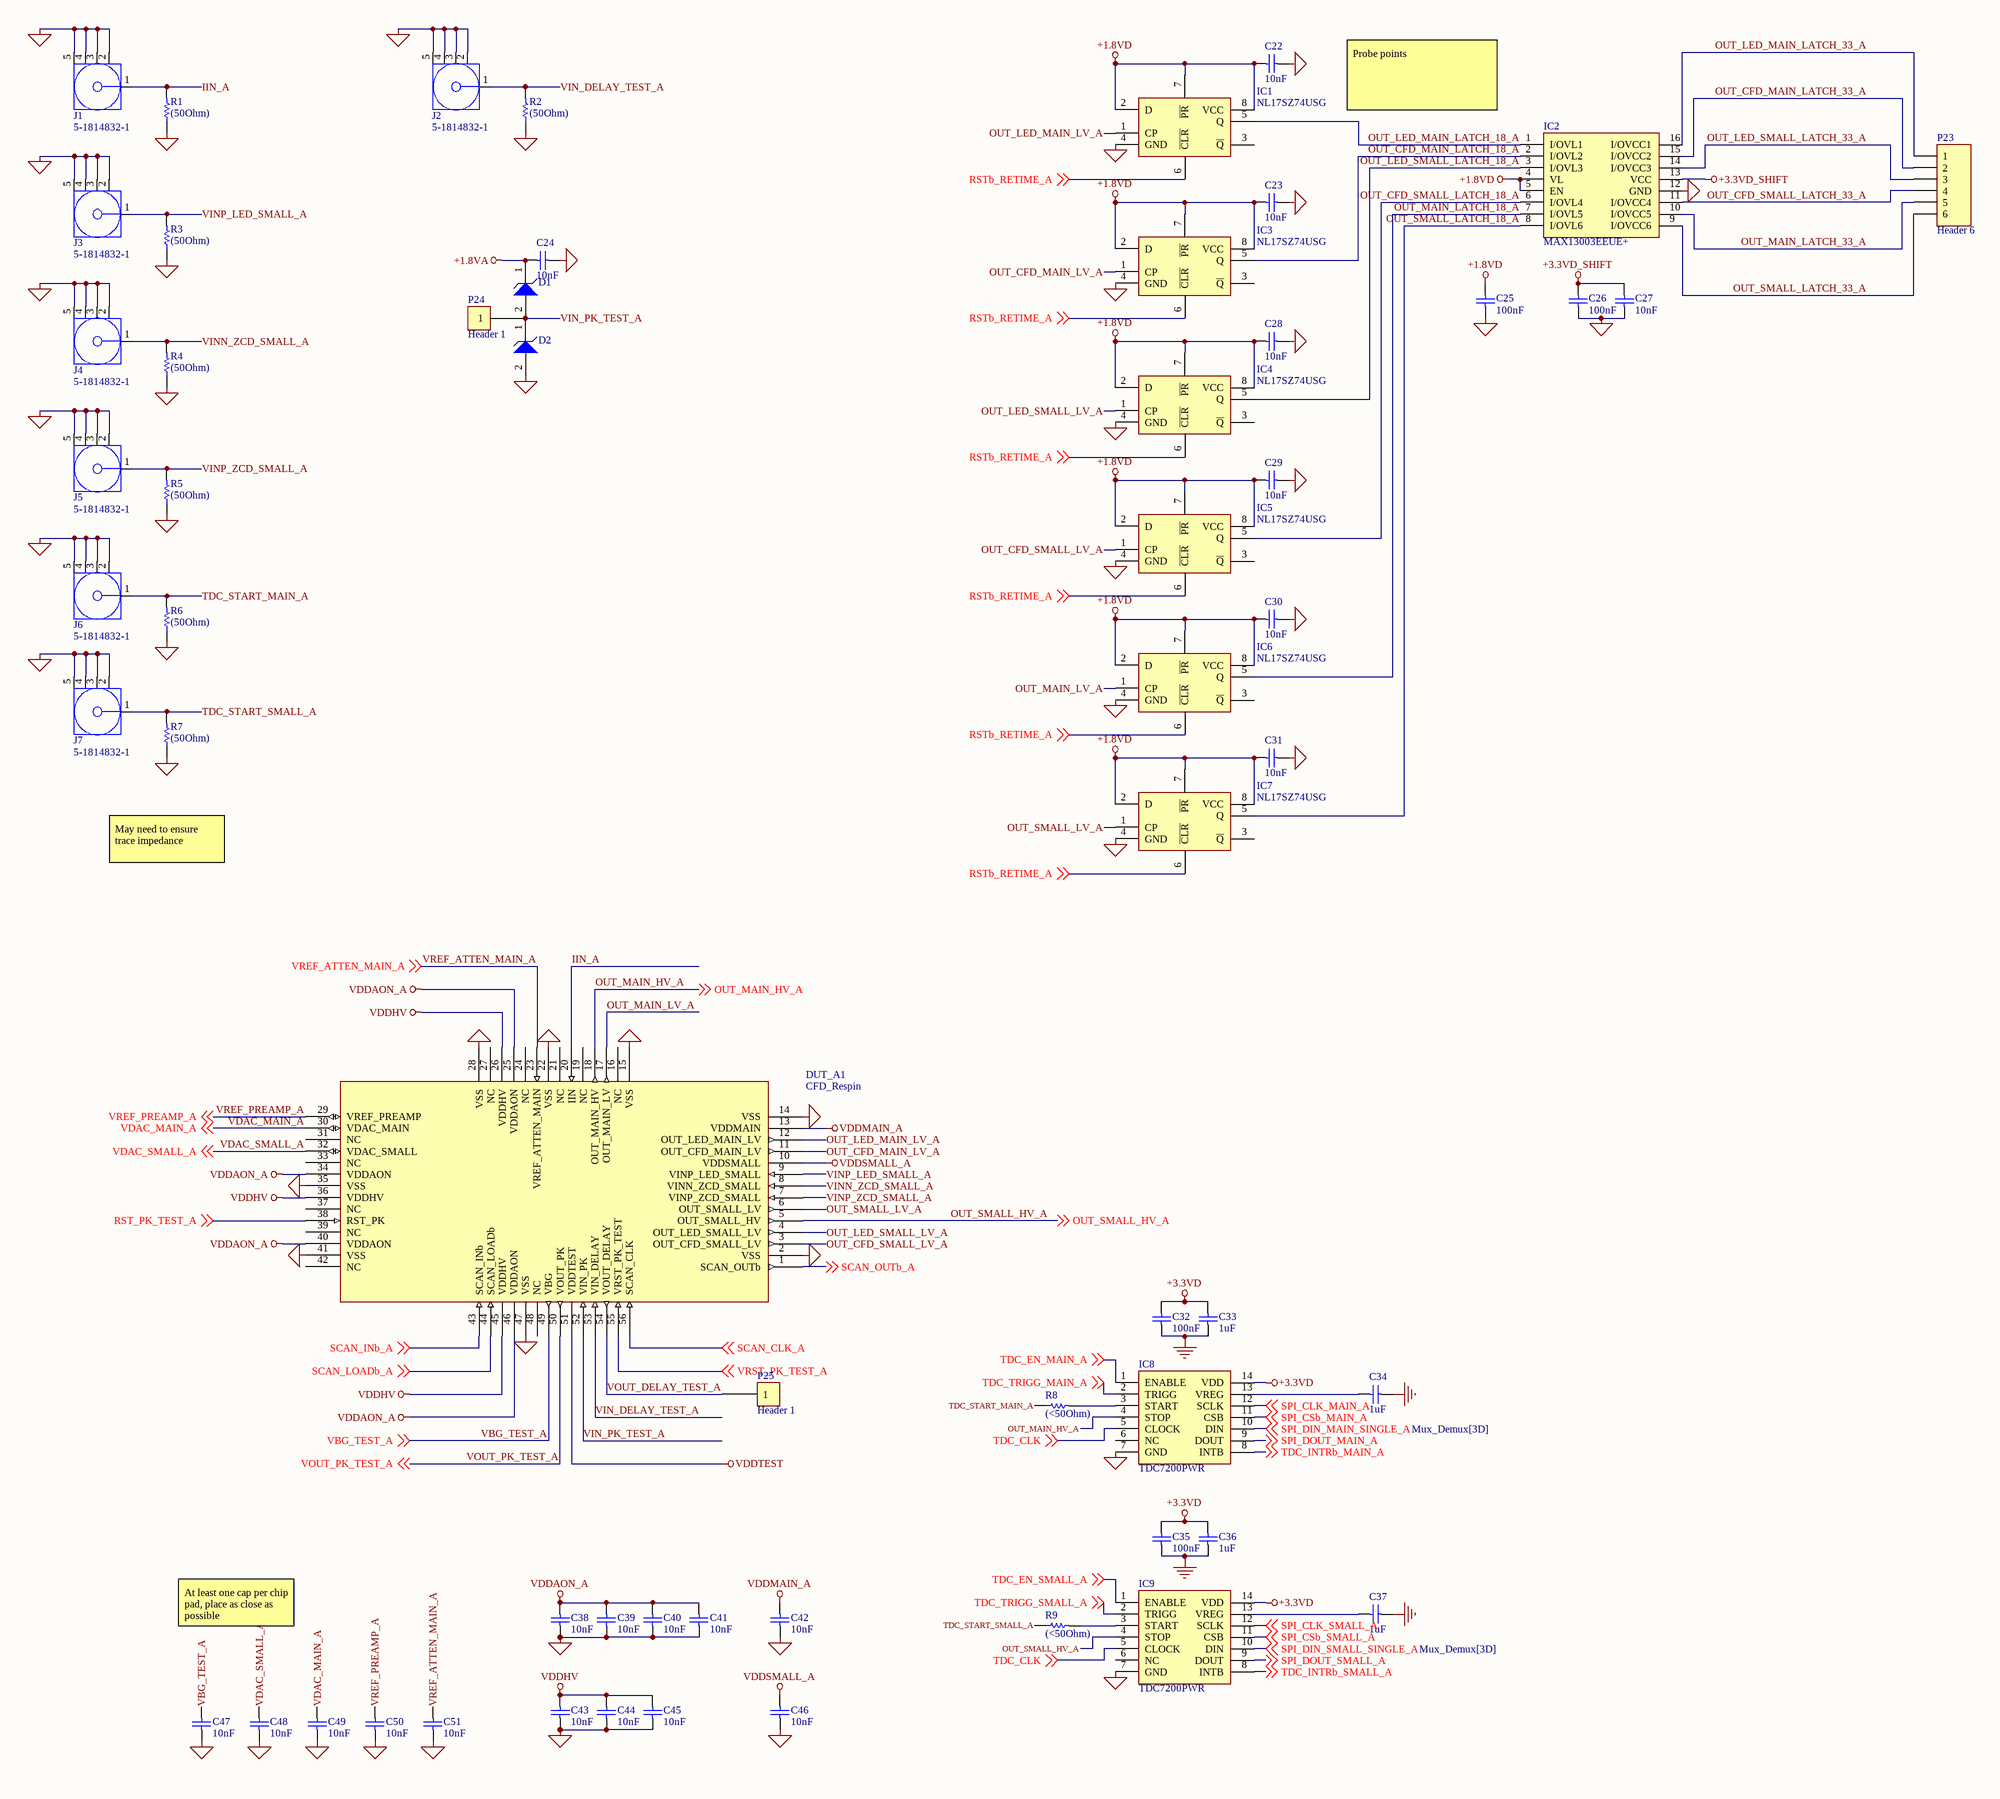
[diagram p4: Channel_A.SchDoc]

### Parts
C22  10nF  [CAPC1608X90X35ML10T15]
C23  10nF  [CAPC1608X90X35ML10T15]
C24  10nF  [CAPC1608X90X35ML10T15]
C25  100nF  [CAPC1608X90X35ML10T15]
C26  100nF  [CAPC1608X90X35ML10T15]
C27  10nF  [CAPC1608X90X35ML10T15]
C28  10nF  [CAPC1608X90X35ML10T15]
C29  10nF  [CAPC1608X90X35ML10T15]
C30  10nF  [CAPC1608X90X35ML10T15]
C31  10nF  [CAPC1608X90X35ML10T15]
C32  100nF  [CAPC1608X90X35ML10T15]
C33  1uF  [CAPC1608X90X35ML10T15]
C34  1uF  [CAPC1608X90X35ML10T15]
C35  100nF  [CAPC1608X90X35ML10T15]
C36  1uF  [CAPC1608X90X35ML10T15]
C37  1uF  [CAPC1608X90X35ML10T15]
C38  10nF  [CAPC1608X90X35ML10T15]
C39  10nF  [CAPC1608X90X35ML10T15]
C40  10nF  [CAPC1608X90X35ML10T15]
C41  10nF  [CAPC1608X90X35ML10T15]
C42  10nF  [CAPC1608X90X35ML10T15]
C43  10nF  [CAPC1608X90X35ML10T15]
C44  10nF  [CAPC1608X90X35ML10T15]
C45  10nF  [CAPC1608X90X35ML10T15]
C46  10nF  [CAPC1608X90X35ML10T15]
C47  10nF  [CAPC1608X90X35ML10T15]
C48  10nF  [CAPC1608X90X35ML10T15]
C49  10nF  [CAPC1608X90X35ML10T15]
C50  10nF  [CAPC1608X90X35ML10T15]
C51  10nF  [CAPC1608X90X35ML10T15]
D1  (no value)  [ONSC-SOD-123-2-425-04_V]
D2  (no value)  [ONSC-SOD-123-2-425-04_V]
DUT_A1  CFD_Respin  [QFN50P800X800X80_HS-57N_WIDEVIAS]
IC1  NL17SZ74USG  [SOP50P310X90-8N]
IC2  MAX13003EEUE+  [SOP65P640X110-16N]
IC3  NL17SZ74USG  [SOP50P310X90-8N]
IC4  NL17SZ74USG  [SOP50P310X90-8N]
IC5  NL17SZ74USG  [SOP50P310X90-8N]
IC6  NL17SZ74USG  [SOP50P310X90-8N]
IC7  NL17SZ74USG  [SOP50P310X90-8N]
IC8  TDC7200PWR  [SOP65P640X120-14N]
IC9  TDC7200PWR  [SOP65P640X120-14N]
J1  5-1814832-1  [TECO-5-1814832-1_V]
J2  5-1814832-1  [TECO-5-1814832-1_V]
J3  5-1814832-1  [TECO-5-1814832-1_V]
J4  5-1814832-1  [TECO-5-1814832-1_V]
J5  5-1814832-1  [TECO-5-1814832-1_V]
J6  5-1814832-1  [TECO-5-1814832-1_V]
J7  5-1814832-1  [TECO-5-1814832-1_V]
P23  Header 6  [HDR1X6]
P24  Header 1  [Header1]
P25  Header 1  [Header1]
R1  (50Ohm)  [RESC1609X50X30NL8T20]
R2  (50Ohm)  [RESC1609X50X30NL8T20]
R3  (50Ohm)  [RESC1609X50X30NL8T20]
R4  (50Ohm)  [RESC1609X50X30NL8T20]
R5  (50Ohm)  [RESC1609X50X30NL8T20]
R6  (50Ohm)  [RESC1609X50X30NL8T20]
R7  (50Ohm)  [RESC1609X50X30NL8T20]
R8  (<50Ohm)  [RESC1609X50X30NL8T20]
R9  (<50Ohm)  [RESC1609X50X30NL8T20]

### Nets
+1.8VA: C24.2 D1.1(K)
+1.8VD: C22.2 C23.2 C25.2 C28.2 C29.2 C30.2 C31.2 IC1.2(D) IC1.7(~{PR}) IC1.8(VCC) IC2.4(VL) IC2.5(EN) IC3.2(D) IC3.7(~{PR}) IC3.8(VCC) IC4.2(D) IC4.7(~{PR}) IC4.8(VCC) IC5.2(D) IC5.7(~{PR}) IC5.8(VCC) IC6.2(D) IC6.7(~{PR}) IC6.8(VCC) IC7.2(D) IC7.7(~{PR}) IC7.8(VCC)
+3.3VD: C32.1 C33.1 C35.1 C36.1 IC8.14(VDD) IC9.14(VDD)
+3.3VD_SHIFT: C26.2 C27.2 IC2.13(VCC)
GND: C22.1 C23.1 C24.1 C25.1 C26.1 C27.1 C28.1 C29.1 C30.1 C31.1 C32.2 C33.2 C34.2 C35.2 C36.2 C37.2 C38.1 C39.1 C40.1 C41.1 C42.1 C43.1 C44.1 C45.1 C46.1 C47.1 C48.1 C49.1 C50.1 C51.1 D2.2(A) DUT_A1.2(VSS) DUT_A1.14(VSS) DUT_A1.15(VSS) DUT_A1.22(VSS) DUT_A1.28(VSS) DUT_A1.35(VSS) DUT_A1.41(VSS) DUT_A1.47(VSS) IC1.4(GND) IC2.12(GND) IC3.4(GND) IC4.4(GND) IC5.4(GND) IC6.4(GND) IC7.4(GND) IC8.7(GND) IC9.7(GND) J1.2 J1.3 J1.4 J1.5 J2.2 J2.3 J2.4 J2.5 J3.2 J3.3 J3.4 J3.5 J4.2 J4.3 J4.4 J4.5 J5.2 J5.3 J5.4 J5.5 J6.2 J6.3 J6.4 J6.5 J7.2 J7.3 J7.4 J7.5 R1.1 R2.1 R3.1 R4.1 R5.1 R6.1 R7.1
VDDAON_A: C38.2 C39.2 C40.2 C41.2 DUT_A1.25(VDDAON) DUT_A1.34(VDDAON) DUT_A1.40(VDDAON) DUT_A1.46(VDDAON)
VDDHV: C43.2 C44.2 C45.2 DUT_A1.26(VDDHV) DUT_A1.36(VDDHV) DUT_A1.45(VDDHV)
VDDMAIN_A: C42.2 DUT_A1.13(VDDMAIN)
VDDSMALL_A: C46.2 DUT_A1.10(VDDSMALL)
VDDTEST: DUT_A1.51(VDDTEST)
IIN_A: DUT_A1.20(IIN) J1.1 R1.2
OUT_CFD_MAIN_LATCH_18_A: IC2.2(I/OVL2) IC3.5(Q)
OUT_CFD_MAIN_LATCH_33_A: IC2.15(I/OVCC2) P23.2
OUT_CFD_MAIN_LV_A: DUT_A1.11(OUT_CFD_MAIN_LV) IC3.1(CP)
OUT_CFD_SMALL_LATCH_18_A: IC2.6(I/OVL4) IC5.5(Q)
OUT_CFD_SMALL_LATCH_33_A: IC2.11(I/OVCC4) P23.4
OUT_CFD_SMALL_LV_A: DUT_A1.3(OUT_CFD_SMALL_LV) IC5.1(CP)
OUT_LED_MAIN_LATCH_18_A: IC1.5(Q) IC2.1(I/OVL1)
OUT_LED_MAIN_LATCH_33_A: IC2.16(I/OVCC1) P23.1
OUT_LED_MAIN_LV_A: DUT_A1.12(OUT_LED_MAIN_LV) IC1.1(CP)
OUT_LED_SMALL_LATCH_18_A: IC2.3(I/OVL3) IC4.5(Q)
OUT_LED_SMALL_LATCH_33_A: IC2.14(I/OVCC3) P23.3
OUT_LED_SMALL_LV_A: DUT_A1.4(OUT_LED_SMALL_LV) IC4.1(CP)
OUT_MAIN_HV_A: DUT_A1.18(OUT_MAIN_HV) IC8.4(STOP) ; off-sheet OUT_MAIN_HV_A
OUT_MAIN_LATCH_18_A: IC2.7(I/OVL5) IC6.5(Q)
OUT_MAIN_LATCH_33_A: IC2.10(I/OVCC5) P23.5
OUT_MAIN_LV_A: DUT_A1.17(OUT_MAIN_LV) IC6.1(CP)
OUT_SMALL_HV_A: DUT_A1.5(OUT_SMALL_HV) IC9.4(STOP) ; off-sheet OUT_SMALL_HV_A
OUT_SMALL_LATCH_18_A: IC2.8(I/OVL6) IC7.5(Q)
OUT_SMALL_LATCH_33_A: IC2.9(I/OVCC6) P23.6
OUT_SMALL_LV_A: DUT_A1.6(OUT_SMALL_LV) IC7.1(CP)
RST_PK_TEST_A: DUT_A1.38(RST_PK) ; off-sheet RST_PK_TEST_A
RSTb_RETIME_A: IC1.6(~{CLR}) IC3.6(~{CLR}) IC4.6(~{CLR}) IC5.6(~{CLR}) IC6.6(~{CLR}) IC7.6(~{CLR}) ; off-sheet RSTb_RETIME_A
SCAN_CLK_A: DUT_A1.56(SCAN_CLK) ; off-sheet SCAN_CLK_A
SCAN_INb_A: DUT_A1.43(SCAN_INb) ; off-sheet SCAN_INb_A
SCAN_LOADb_A: DUT_A1.44(SCAN_LOADb) ; off-sheet SCAN_LOADb_A
SCAN_OUTb_A: DUT_A1.1(SCAN_OUTb) ; off-sheet SCAN_OUTb_A
SPI_CLK_MAIN_A: IC8.12(SCLK) ; off-sheet SPI_CLK_MAIN_A
SPI_CLK_SMALL_A: IC9.12(SCLK) ; off-sheet SPI_CLK_SMALL_A
SPI_CSb_MAIN_A: IC8.11(CSB) ; off-sheet SPI_CSb_MAIN_A
SPI_CSb_SMALL_A: IC9.11(CSB) ; off-sheet SPI_CSb_SMALL_A
SPI_DIN_MAIN_SINGLE_A: IC8.10(DIN) ; off-sheet SPI_DIN_MAIN_SINGLE_A
SPI_DIN_SMALL_SINGLE_A: IC9.10(DIN) ; off-sheet SPI_DIN_SMALL_SINGLE_A
SPI_DOUT_MAIN_A: IC8.9(DOUT) ; off-sheet SPI_DOUT_MAIN_A
SPI_DOUT_SMALL_A: IC9.9(DOUT) ; off-sheet SPI_DOUT_SMALL_A
TDC_CLK: IC8.5(CLOCK) IC9.5(CLOCK) ; off-sheet TDC_CLK
TDC_EN_MAIN_A: IC8.1(ENABLE) ; off-sheet TDC_EN_MAIN_A
TDC_EN_SMALL_A: IC9.1(ENABLE) ; off-sheet TDC_EN_SMALL_A
TDC_INTRb_MAIN_A: IC8.8(INTB) ; off-sheet TDC_INTRb_MAIN_A
TDC_INTRb_SMALL_A: IC9.8(INTB) ; off-sheet TDC_INTRb_SMALL_A
TDC_START_MAIN_A: J6.1 R6.2 R8.1
TDC_START_SMALL_A: J7.1 R7.2 R9.1
TDC_TRIGG_MAIN_A: IC8.2(TRIGG) ; off-sheet TDC_TRIGG_MAIN_A
TDC_TRIGG_SMALL_A: IC9.2(TRIGG) ; off-sheet TDC_TRIGG_SMALL_A
VBG_TEST_A: C47.2 DUT_A1.49(VBG) ; off-sheet VBG_TEST_A
VDAC_MAIN_A: C49.2 DUT_A1.30(VDAC_MAIN) ; off-sheet VDAC_MAIN_A
VDAC_SMALL_A: C48.2 DUT_A1.32(VDAC_SMALL) ; off-sheet VDAC_SMALL_A
VIN_DELAY_TEST_A: DUT_A1.53(VIN_DELAY) J2.1 R2.2
VIN_PK_TEST_A: D1.2(A) D2.1(K) DUT_A1.52(VIN_PK) P24.1
VINN_ZCD_SMALL_A: DUT_A1.8(VINN_ZCD_SMALL) J4.1 R4.2
VINP_LED_SMALL_A: DUT_A1.9(VINP_LED_SMALL) J3.1 R3.2
VINP_ZCD_SMALL_A: DUT_A1.7(VINP_ZCD_SMALL) J5.1 R5.2
VOUT_DELAY_TEST_A: DUT_A1.54(VOUT_DELAY) P25.1
VOUT_PK_TEST_A: DUT_A1.50(VOUT_PK) ; off-sheet VOUT_PK_TEST_A
VREF_ATTEN_MAIN_A: C51.2 DUT_A1.23(VREF_ATTEN_MAIN) ; off-sheet VREF_ATTEN_MAIN_A
VREF_PREAMP_A: C50.2 DUT_A1.29(VREF_PREAMP) ; off-sheet VREF_PREAMP_A
VRST_PK_TEST_A: DUT_A1.55(VRST_PK_TEST) ; off-sheet VRST_PK_TEST_A
NetC34_1: C34.1 IC8.13(VREG)
NetC37_1: C37.1 IC9.13(VREG)
NetIC8_3: IC8.3(START) R8.2
NetIC9_3: IC9.3(START) R9.2

Not connected (* = marked no-connect by the designer): DUT_A1 16(NC) 19(NC) 21(NC) 24(NC) 27(NC) 31(NC) 33(NC) 37(NC) 39(NC) 42(NC) 48(NC); IC1 3(~{Q}); IC3 3(~{Q}); IC4 3(~{Q}); IC5 3(~{Q}); IC6 3(~{Q}); IC7 3(~{Q}); IC8 6(NC); IC9 6(NC)

### Notes on the sheet
- Probe points
- May need to ensure trace impedance
- At least one cap per chip pad, place as close as possible

### Library data of the parts
C22-C51 = CMP-2000-04945-1: as C1 on sheet Power; Manufacturer URL: http://www.murata.com/; Datasheet Version: Jul-06; Package Reference: 603; Case Size/Dimension: 0603; Package Description: 2-Pin Surface Mount Device, Body 1.6 x 0.8 mm; Datasheet URL: https://datasheet.ciiva.com/11786/0900766b807a1cab-11786398.pdf
D1 D2 = CMP-1060-00509-1: Zener Voltage Regulator, 2-Pin SOD-123, Pb-Free, Tape and Reel; Manufacturer: On Semiconductor; PartNumber: MMSZ4679T1G; P Max (W): 0.5; VZ Typ (V): 2; Packing: Tape and Reel; ComponentLink1Description: Manufacturer URL; DatasheetVersion: Rev. 9; PackageReference: SOD-123-2-425-04; ComponentLink3URL: http://www.onsemi.com/pub_link/Collateral/425-04.PDF; PackageDescription: 2-Pin SOD, Body 1.6 x 2.69 mm; ComponentLink3Description: Package Specification; ComponentLink2Description: Datasheet; ComponentLink1URL: http://www.onsemi.com/; RoHS: Pb-Free; PackageVersion: Rev. G, 10/2009; ComponentLink2URL: http://www.onsemi.com/pub_link/Collateral/MMSZ4678T1-D.PDF; Mounting Technology: Surface Mount
IC1 IC3-IC7 = NL17SZ74USG: Flip Flops 1.65-5.5V CMOS Single D-Type; Manufacturer_Name: ON Semiconductor; Datasheet Link: http://www.onsemi.com/pub/Collateral/NL17SZ74-D.PDF; Height: 0.9mm; Manufacturer_Part_Number: NL17SZ74USG
IC2 = MAX13003EEUE+: as IC19 on sheet Teensy_Interface; Datasheet Link: https://pdfserv.maximintegrated.com/en/ds/MAX13000E-MAX13005E.pdf; Height: 1.1mm; Manufacturer_Part_Number: MAX13003EEUE+
IC8 IC9 = TDC7200PWR: as IC20 on sheet Dual_Channel; Datasheet Link: http://www.ti.com/lit/gpn/tdc7200; Height: 1.2mm; Manufacturer_Part_Number: TDC7200PWR
J1-J7 = CMP-2000-05415-1: SMA Connector, Pitch 5.08 mm, 1 Position, Height 9.5 mm, Tail Length 4 mm, -65 to 165 degC, RoHS, Bulk; Manufacturer: TE Connectivity; Connector Mounting: PCBMount; Connector Body Style: StraightJack; Impedance: 50ohm; Coaxial Termination: Solder; SVHC: NoSVHC(15-Jun-2015); Frequency Max: 3GHz; Product Range: ZDCSeries; Connector Type: SMACoaxial; Datasheet Version: Rev. B1, 03/2011; Package Reference: 5-1814832-1; Package Description: SMA Connector, Pitch 5.08 mm, 1 Position, Height 9.5 mm, Tail Length 4 mm; Contact Plating: GoldPlatedContacts; Coaxial Cable Types: -; Contact Material: BerylliumCopper; Manufacturer URL: http://www.te.com/; Datasheet URL: http://www.onlinecomponents.com/productFiles/mf-AMP/eng_cd_1814832_a.pdf
P23 = Header 6: Header, 6-Pin; LatestRevisionDate: 17-Jul-2002; LatestRevisionNote: Re-released for DXP Platform.; Publisher: Altium Limited
R1-R9 = CMP-2000-03816-5: as R19 on sheet Mux_Demux; Package Quantity: 5000; DatasheetVersion: 06/2012; Min Operating Temperature: -55 degC; ComponentLink1URL: http://www.vishay.com/; Mounting Technology: Surface Mount; Height: 0.45 mm; ComponentLink1Description: Manufacturer URL; REACH SVHC: Unknown; PackageReference: 0603; Packaging: Tape and Reel; Max Operating Temperature: 155 degC; Mount: Surface Mount; ComponentLink2Description: Datasheet; PackageDescription: 2-Pin Surface Mount Device, Body 1.575 x 0.85 mm; Length: 1.55 mm; ComponentLink2URL: http://www.vishay.com/docs/20035/dcrcwe3.pdf; Pins: 2; RoHSCompliant: true

## Sheet Channel_B.SchDoc
size OrCAD E; SheetNumber: 6; SheetTotal: 6
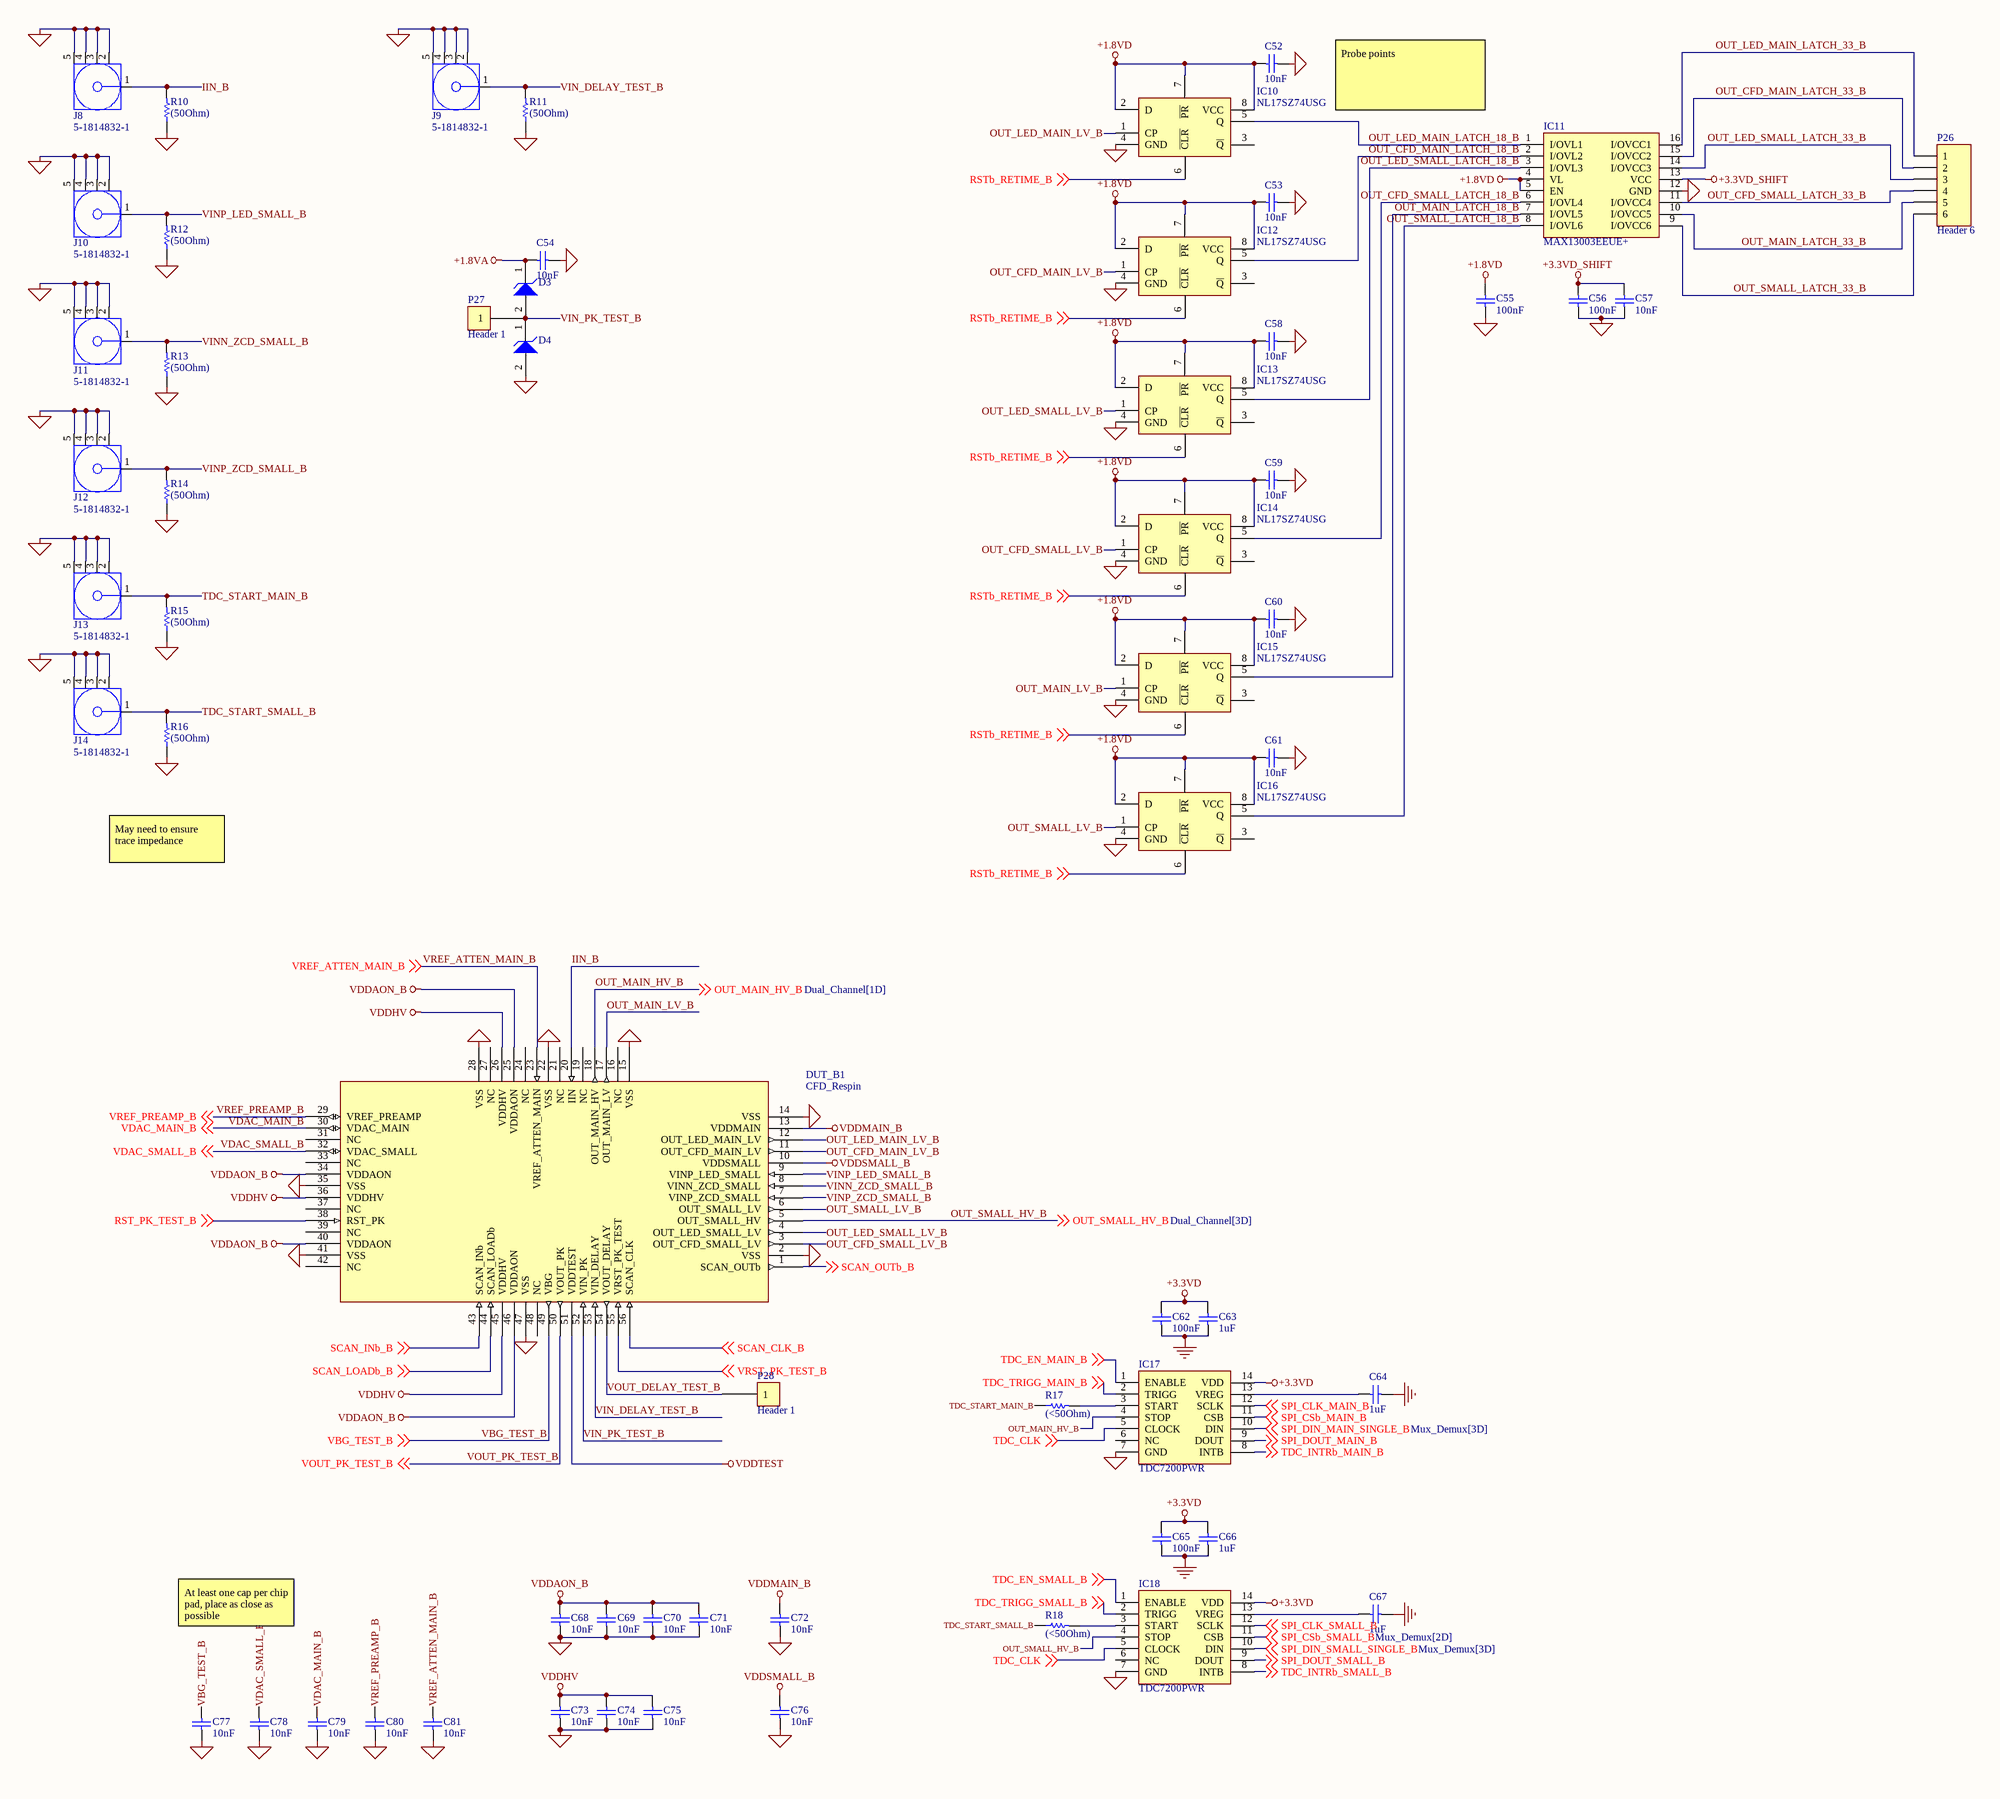
[diagram p5: Channel_B.SchDoc]

### Parts
C52  10nF  [CAPC1608X90X35ML10T15]
C53  10nF  [CAPC1608X90X35ML10T15]
C54  10nF  [CAPC1608X90X35ML10T15]
C55  100nF  [CAPC1608X90X35ML10T15]
C56  100nF  [CAPC1608X90X35ML10T15]
C57  10nF  [CAPC1608X90X35ML10T15]
C58  10nF  [CAPC1608X90X35ML10T15]
C59  10nF  [CAPC1608X90X35ML10T15]
C60  10nF  [CAPC1608X90X35ML10T15]
C61  10nF  [CAPC1608X90X35ML10T15]
C62  100nF  [CAPC1608X90X35ML10T15]
C63  1uF  [CAPC1608X90X35ML10T15]
C64  1uF  [CAPC1608X90X35ML10T15]
C65  100nF  [CAPC1608X90X35ML10T15]
C66  1uF  [CAPC1608X90X35ML10T15]
C67  1uF  [CAPC1608X90X35ML10T15]
C68  10nF  [CAPC1608X90X35ML10T15]
C69  10nF  [CAPC1608X90X35ML10T15]
C70  10nF  [CAPC1608X90X35ML10T15]
C71  10nF  [CAPC1608X90X35ML10T15]
C72  10nF  [CAPC1608X90X35ML10T15]
C73  10nF  [CAPC1608X90X35ML10T15]
C74  10nF  [CAPC1608X90X35ML10T15]
C75  10nF  [CAPC1608X90X35ML10T15]
C76  10nF  [CAPC1608X90X35ML10T15]
C77  10nF  [CAPC1608X90X35ML10T15]
C78  10nF  [CAPC1608X90X35ML10T15]
C79  10nF  [CAPC1608X90X35ML10T15]
C80  10nF  [CAPC1608X90X35ML10T15]
C81  10nF  [CAPC1608X90X35ML10T15]
D3  (no value)  [ONSC-SOD-123-2-425-04_V]
D4  (no value)  [ONSC-SOD-123-2-425-04_V]
DUT_B1  CFD_Respin  [QFN50P800X800X80_HS-57N_WIDEVIAS]
IC10  NL17SZ74USG  [SOP50P310X90-8N]
IC11  MAX13003EEUE+  [SOP65P640X110-16N]
IC12  NL17SZ74USG  [SOP50P310X90-8N]
IC13  NL17SZ74USG  [SOP50P310X90-8N]
IC14  NL17SZ74USG  [SOP50P310X90-8N]
IC15  NL17SZ74USG  [SOP50P310X90-8N]
IC16  NL17SZ74USG  [SOP50P310X90-8N]
IC17  TDC7200PWR  [SOP65P640X120-14N]
IC18  TDC7200PWR  [SOP65P640X120-14N]
J8  5-1814832-1  [TECO-5-1814832-1_V]
J9  5-1814832-1  [TECO-5-1814832-1_V]
J10  5-1814832-1  [TECO-5-1814832-1_V]
J11  5-1814832-1  [TECO-5-1814832-1_V]
J12  5-1814832-1  [TECO-5-1814832-1_V]
J13  5-1814832-1  [TECO-5-1814832-1_V]
J14  5-1814832-1  [TECO-5-1814832-1_V]
P26  Header 6  [HDR1X6]
P27  Header 1  [Header1]
P28  Header 1  [Header1]
R10  (50Ohm)  [RESC1609X50X30NL8T20]
R11  (50Ohm)  [RESC1609X50X30NL8T20]
R12  (50Ohm)  [RESC1609X50X30NL8T20]
R13  (50Ohm)  [RESC1609X50X30NL8T20]
R14  (50Ohm)  [RESC1609X50X30NL8T20]
R15  (50Ohm)  [RESC1609X50X30NL8T20]
R16  (50Ohm)  [RESC1609X50X30NL8T20]
R17  (<50Ohm)  [RESC1609X50X30NL8T20]
R18  (<50Ohm)  [RESC1609X50X30NL8T20]

### Nets
+1.8VA: C54.2 D3.1(K)
+1.8VD: C52.2 C53.2 C55.2 C58.2 C59.2 C60.2 C61.2 IC10.2(D) IC10.7(~{PR}) IC10.8(VCC) IC11.4(VL) IC11.5(EN) IC12.2(D) IC12.7(~{PR}) IC12.8(VCC) IC13.2(D) IC13.7(~{PR}) IC13.8(VCC) IC14.2(D) IC14.7(~{PR}) IC14.8(VCC) IC15.2(D) IC15.7(~{PR}) IC15.8(VCC) IC16.2(D) IC16.7(~{PR}) IC16.8(VCC)
+3.3VD: C62.1 C63.1 C65.1 C66.1 IC17.14(VDD) IC18.14(VDD)
+3.3VD_SHIFT: C56.2 C57.2 IC11.13(VCC)
GND: C52.1 C53.1 C54.1 C55.1 C56.1 C57.1 C58.1 C59.1 C60.1 C61.1 C62.2 C63.2 C64.2 C65.2 C66.2 C67.2 C68.1 C69.1 C70.1 C71.1 C72.1 C73.1 C74.1 C75.1 C76.1 C77.1 C78.1 C79.1 C80.1 C81.1 D4.2(A) DUT_B1.2(VSS) DUT_B1.14(VSS) DUT_B1.15(VSS) DUT_B1.22(VSS) DUT_B1.28(VSS) DUT_B1.35(VSS) DUT_B1.41(VSS) DUT_B1.47(VSS) IC10.4(GND) IC11.12(GND) IC12.4(GND) IC13.4(GND) IC14.4(GND) IC15.4(GND) IC16.4(GND) IC17.7(GND) IC18.7(GND) J8.2 J8.3 J8.4 J8.5 J9.2 J9.3 J9.4 J9.5 J10.2 J10.3 J10.4 J10.5 J11.2 J11.3 J11.4 J11.5 J12.2 J12.3 J12.4 J12.5 J13.2 J13.3 J13.4 J13.5 J14.2 J14.3 J14.4 J14.5 R10.1 R11.1 R12.1 R13.1 R14.1 R15.1 R16.1
VDDAON_B: C68.2 C69.2 C70.2 C71.2 DUT_B1.25(VDDAON) DUT_B1.34(VDDAON) DUT_B1.40(VDDAON) DUT_B1.46(VDDAON)
VDDHV: C73.2 C74.2 C75.2 DUT_B1.26(VDDHV) DUT_B1.36(VDDHV) DUT_B1.45(VDDHV)
VDDMAIN_B: C72.2 DUT_B1.13(VDDMAIN)
VDDSMALL_B: C76.2 DUT_B1.10(VDDSMALL)
VDDTEST: DUT_B1.51(VDDTEST)
IIN_B: DUT_B1.20(IIN) J8.1 R10.2
OUT_CFD_MAIN_LATCH_18_B: IC11.2(I/OVL2) IC12.5(Q)
OUT_CFD_MAIN_LATCH_33_B: IC11.15(I/OVCC2) P26.2
OUT_CFD_MAIN_LV_B: DUT_B1.11(OUT_CFD_MAIN_LV) IC12.1(CP)
OUT_CFD_SMALL_LATCH_18_B: IC11.6(I/OVL4) IC14.5(Q)
OUT_CFD_SMALL_LATCH_33_B: IC11.11(I/OVCC4) P26.4
OUT_CFD_SMALL_LV_B: DUT_B1.3(OUT_CFD_SMALL_LV) IC14.1(CP)
OUT_LED_MAIN_LATCH_18_B: IC10.5(Q) IC11.1(I/OVL1)
OUT_LED_MAIN_LATCH_33_B: IC11.16(I/OVCC1) P26.1
OUT_LED_MAIN_LV_B: DUT_B1.12(OUT_LED_MAIN_LV) IC10.1(CP)
OUT_LED_SMALL_LATCH_18_B: IC11.3(I/OVL3) IC13.5(Q)
OUT_LED_SMALL_LATCH_33_B: IC11.14(I/OVCC3) P26.3
OUT_LED_SMALL_LV_B: DUT_B1.4(OUT_LED_SMALL_LV) IC13.1(CP)
OUT_MAIN_HV_B: DUT_B1.18(OUT_MAIN_HV) IC17.4(STOP) ; off-sheet OUT_MAIN_HV_B
OUT_MAIN_LATCH_18_B: IC11.7(I/OVL5) IC15.5(Q)
OUT_MAIN_LATCH_33_B: IC11.10(I/OVCC5) P26.5
OUT_MAIN_LV_B: DUT_B1.17(OUT_MAIN_LV) IC15.1(CP)
OUT_SMALL_HV_B: DUT_B1.5(OUT_SMALL_HV) IC18.4(STOP) ; off-sheet OUT_SMALL_HV_B
OUT_SMALL_LATCH_18_B: IC11.8(I/OVL6) IC16.5(Q)
OUT_SMALL_LATCH_33_B: IC11.9(I/OVCC6) P26.6
OUT_SMALL_LV_B: DUT_B1.6(OUT_SMALL_LV) IC16.1(CP)
RST_PK_TEST_B: DUT_B1.38(RST_PK) ; off-sheet RST_PK_TEST_B  [project net RST_PK_TEST_A]
RSTb_RETIME_B: IC10.6(~{CLR}) IC12.6(~{CLR}) IC13.6(~{CLR}) IC14.6(~{CLR}) IC15.6(~{CLR}) IC16.6(~{CLR}) ; off-sheet RSTb_RETIME_B
SCAN_CLK_B: DUT_B1.56(SCAN_CLK) ; off-sheet SCAN_CLK_B
SCAN_INb_B: DUT_B1.43(SCAN_INb) ; off-sheet SCAN_INb_B  [project net SCAN_INb_A]
SCAN_LOADb_B: DUT_B1.44(SCAN_LOADb) ; off-sheet SCAN_LOADb_B
SCAN_OUTb_B: DUT_B1.1(SCAN_OUTb) ; off-sheet SCAN_OUTb_B
SPI_CLK_MAIN_B: IC17.12(SCLK) ; off-sheet SPI_CLK_MAIN_B
SPI_CLK_SMALL_B: IC18.12(SCLK) ; off-sheet SPI_CLK_SMALL_B
SPI_CSb_MAIN_B: IC17.11(CSB) ; off-sheet SPI_CSb_MAIN_B
SPI_CSb_SMALL_B: IC18.11(CSB) ; off-sheet SPI_CSb_SMALL_B
SPI_DIN_MAIN_SINGLE_B: IC17.10(DIN) ; off-sheet SPI_DIN_MAIN_SINGLE_B
SPI_DIN_SMALL_SINGLE_B: IC18.10(DIN) ; off-sheet SPI_DIN_SMALL_SINGLE_B
SPI_DOUT_MAIN_B: IC17.9(DOUT) ; off-sheet SPI_DOUT_MAIN_B
SPI_DOUT_SMALL_B: IC18.9(DOUT) ; off-sheet SPI_DOUT_SMALL_B
TDC_CLK: IC17.5(CLOCK) IC18.5(CLOCK) ; off-sheet TDC_CLK
TDC_EN_MAIN_B: IC17.1(ENABLE) ; off-sheet TDC_EN_MAIN_B
TDC_EN_SMALL_B: IC18.1(ENABLE) ; off-sheet TDC_EN_SMALL_B
TDC_INTRb_MAIN_B: IC17.8(INTB) ; off-sheet TDC_INTRb_MAIN_B
TDC_INTRb_SMALL_B: IC18.8(INTB) ; off-sheet TDC_INTRb_SMALL_B
TDC_START_MAIN_B: J13.1 R15.2 R17.1
TDC_START_SMALL_B: J14.1 R16.2 R18.1
TDC_TRIGG_MAIN_B: IC17.2(TRIGG) ; off-sheet TDC_TRIGG_MAIN_B
TDC_TRIGG_SMALL_B: IC18.2(TRIGG) ; off-sheet TDC_TRIGG_SMALL_B
VBG_TEST_B: C77.2 DUT_B1.49(VBG) ; off-sheet VBG_TEST_B
VDAC_MAIN_B: C79.2 DUT_B1.30(VDAC_MAIN) ; off-sheet VDAC_MAIN_B
VDAC_SMALL_B: C78.2 DUT_B1.32(VDAC_SMALL) ; off-sheet VDAC_SMALL_B
VIN_DELAY_TEST_B: DUT_B1.53(VIN_DELAY) J9.1 R11.2
VIN_PK_TEST_B: D3.2(A) D4.1(K) DUT_B1.52(VIN_PK) P27.1
VINN_ZCD_SMALL_B: DUT_B1.8(VINN_ZCD_SMALL) J11.1 R13.2
VINP_LED_SMALL_B: DUT_B1.9(VINP_LED_SMALL) J10.1 R12.2
VINP_ZCD_SMALL_B: DUT_B1.7(VINP_ZCD_SMALL) J12.1 R14.2
VOUT_DELAY_TEST_B: DUT_B1.54(VOUT_DELAY) P28.1
VOUT_PK_TEST_B: DUT_B1.50(VOUT_PK) ; off-sheet VOUT_PK_TEST_B
VREF_ATTEN_MAIN_B: C81.2 DUT_B1.23(VREF_ATTEN_MAIN) ; off-sheet VREF_ATTEN_MAIN_B
VREF_PREAMP_B: C80.2 DUT_B1.29(VREF_PREAMP) ; off-sheet VREF_PREAMP_B
VRST_PK_TEST_B: DUT_B1.55(VRST_PK_TEST) ; off-sheet VRST_PK_TEST_B
NetC64_1: C64.1 IC17.13(VREG)
NetC67_1: C67.1 IC18.13(VREG)
NetIC17_3: IC17.3(START) R17.2
NetIC18_3: IC18.3(START) R18.2

Not connected (* = marked no-connect by the designer): DUT_B1 16(NC) 19(NC) 21(NC) 24(NC) 27(NC) 31(NC) 33(NC) 37(NC) 39(NC) 42(NC) 48(NC); IC10 3(~{Q}); IC12 3(~{Q}); IC13 3(~{Q}); IC14 3(~{Q}); IC15 3(~{Q}); IC16 3(~{Q}); IC17 6(NC); IC18 6(NC)

### Notes on the sheet
- Probe points
- May need to ensure trace impedance
- At least one cap per chip pad, place as close as possible

### Library data of the parts
C52-C81 = CMP-2000-04945-1: as C1 on sheet Power; Manufacturer URL: http://www.murata.com/; Datasheet Version: Jul-06; Package Reference: 603; Case Size/Dimension: 0603; Package Description: 2-Pin Surface Mount Device, Body 1.6 x 0.8 mm; Datasheet URL: https://datasheet.ciiva.com/11786/0900766b807a1cab-11786398.pdf
D3 D4 = CMP-1060-00509-1: as D1 on sheet Channel_A; Packing: Tape and Reel; ComponentLink1Description: Manufacturer URL; DatasheetVersion: Rev. 9; PackageReference: SOD-123-2-425-04; ComponentLink3URL: http://www.onsemi.com/pub_link/Collateral/425-04.PDF; PackageDescription: 2-Pin SOD, Body 1.6 x 2.69 mm; ComponentLink3Description: Package Specification; ComponentLink2Description: Datasheet; ComponentLink1URL: http://www.onsemi.com/; RoHS: Pb-Free; PackageVersion: Rev. G, 10/2009; ComponentLink2URL: http://www.onsemi.com/pub_link/Collateral/MMSZ4678T1-D.PDF; Mounting Technology: Surface Mount
IC10 IC12-IC16 = NL17SZ74USG: as IC1 on sheet Channel_A; Datasheet Link: http://www.onsemi.com/pub/Collateral/NL17SZ74-D.PDF; Height: 0.9mm; Manufacturer_Part_Number: NL17SZ74USG
IC11 = MAX13003EEUE+: as IC19 on sheet Teensy_Interface; Datasheet Link: https://pdfserv.maximintegrated.com/en/ds/MAX13000E-MAX13005E.pdf; Height: 1.1mm; Manufacturer_Part_Number: MAX13003EEUE+
IC17 IC18 = TDC7200PWR: as IC20 on sheet Dual_Channel; Datasheet Link: http://www.ti.com/lit/gpn/tdc7200; Height: 1.2mm; Manufacturer_Part_Number: TDC7200PWR
J8-J14 = CMP-2000-05415-1: as J1 on sheet Channel_A; Datasheet Version: Rev. B1, 03/2011; Package Reference: 5-1814832-1; Package Description: SMA Connector, Pitch 5.08 mm, 1 Position, Height 9.5 mm, Tail Length 4 mm; Contact Plating: GoldPlatedContacts; Coaxial Cable Types: -; Contact Material: BerylliumCopper; Manufacturer URL: http://www.te.com/; Datasheet URL: http://www.onlinecomponents.com/productFiles/mf-AMP/eng_cd_1814832_a.pdf
P26 = Header 6: Header, 6-Pin; LatestRevisionDate: 17-Jul-2002; LatestRevisionNote: Re-released for DXP Platform.; Publisher: Altium Limited
R10-R18 = CMP-2000-03816-5: as R19 on sheet Mux_Demux; Package Quantity: 5000; DatasheetVersion: 06/2012; Min Operating Temperature: -55 degC; ComponentLink1URL: http://www.vishay.com/; Mounting Technology: Surface Mount; Height: 0.45 mm; ComponentLink1Description: Manufacturer URL; REACH SVHC: Unknown; PackageReference: 0603; Packaging: Tape and Reel; Max Operating Temperature: 155 degC; Mount: Surface Mount; ComponentLink2Description: Datasheet; PackageDescription: 2-Pin Surface Mount Device, Body 1.575 x 0.85 mm; Length: 1.55 mm; ComponentLink2URL: http://www.vishay.com/docs/20035/dcrcwe3.pdf; Pins: 2; RoHSCompliant: true